# EAGLE schematic EEZ PSU consolidated r5B11 (EAGLE 6.1), part 1 of 2
Assembly variants: Farnell, TME

## Sheet 1 of 11: Power pre-regulator
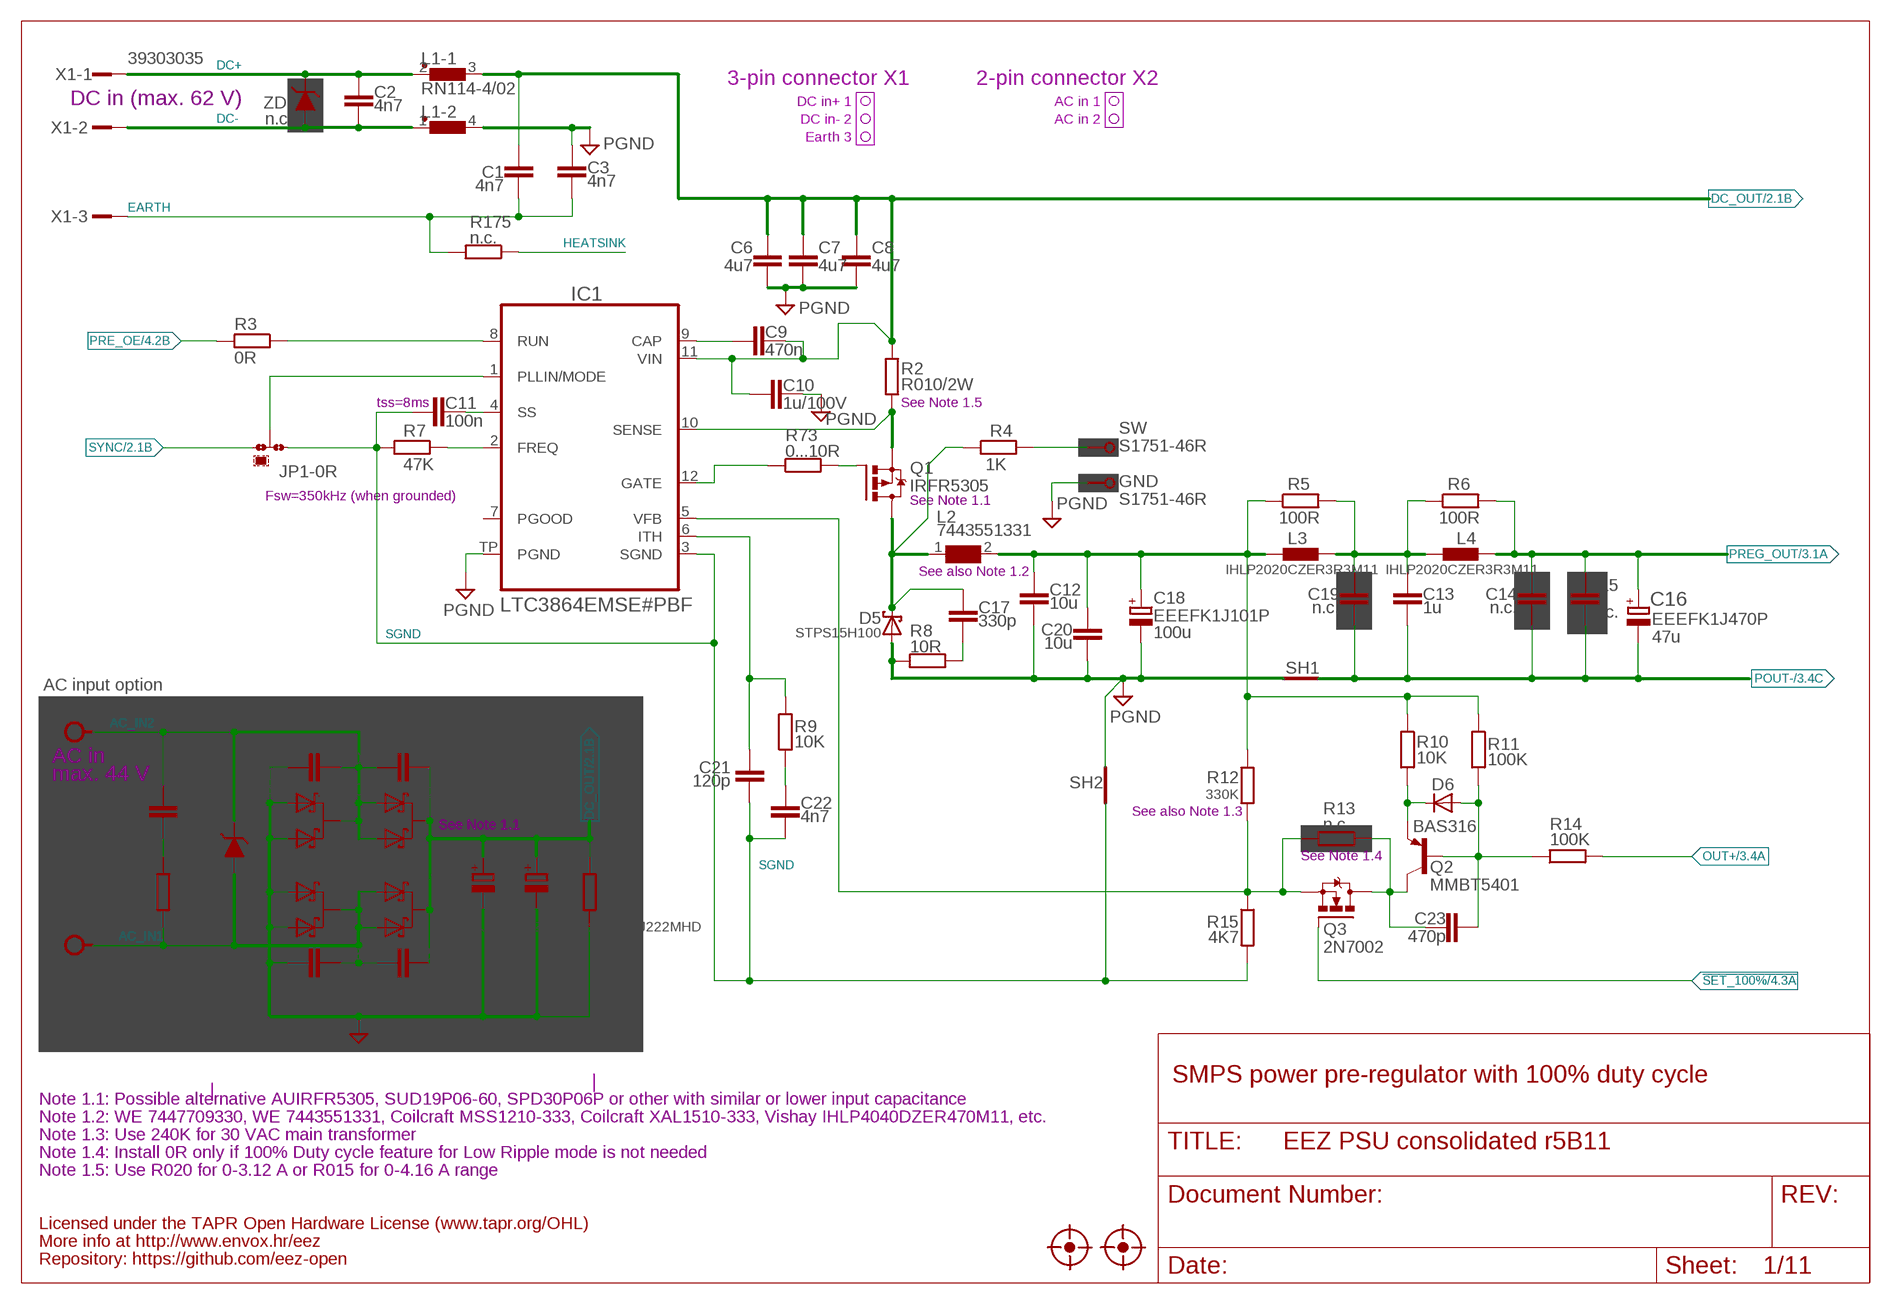
[diagram p0: schematic, sheet 1]

### Parts
C1  4n7  C-EUC1206  [C1206]
C2  4n7  C-EUC1206  [C1206]
C3  4n7  C-EUC1206  [C1206]
C4  2m2  ECAP7.5G_18MM  [ECAP7.5/18]
C5  2m2  ECAP7.5G_18MM  [ECAP7.5/18]
C6  4u7  C-EUC1210  [C1210]
C7  4u7  C-EUC1210  [C1210]
C8  4u7  C-EUC1210  [C1210]
C9  470n  C-EUC0805  [C0805]
C10  1u/100V  C-EUC1206  [C1206]
C11  100n  C-EUC0603  [C0603]
C12  10u  C-EUC1210  [C1210]
C13  1u  C-EUC0805  [C0805]
C14  n.c.  C-EUC0805  [C0805]
C15  n.c.  C-EUC0805  [C0805]
C16  EEEFK1J470P  EEE-FK1J470P-CASE-F  [CAPAE830X1050N]
C17  330p  C-EUC0805  [C0805]
C18  EEEFK1J101P  ECAPF  [PANASONIC_F]
C19  n.c.  C-EUC0805  [C0805]
C20  10u  C-EUC1210  [C1210]
C21  120p  C-EUC0805  [C0805]
C22  4n7  C-EUC0805  [C0805]
C23  470p  C-EUC0805  [C0805]
C158  n.c  C-EUC1206  [C1206]
C200  1n  C-EUC1206  [C1206]
C201  1n  C-EUC1206  [C1206]
C202  1n  C-EUC1206  [C1206]
C203  1n  C-EUC1206  [C1206]
D1  STPS15H100  VS-6CWQ06FNPBF  [TO252@1]
D2  STPS15H100  VS-6CWQ06FNPBF  [TO252@1]
D3  STPS15H100  VS-6CWQ06FNPBF  [TO252@1]
D4  STPS15H100  VS-6CWQ06FNPBF  [TO252@1]
D5  STPS15H100  SCHOTTKYTO252  [TO252]
D6  BAS316  DIODE-SOD323-W  [SOD323-W]
FM1  FIDUCIAL_2  [FIDUCIAL_DUAL]
FM2  FIDUCIAL_2  [FIDUCIAL_DUAL]
GND  S1751-46R  PCB_TEST_TABSMD  [S1751-46R]
IC1  LTC3864EMSE#PBF  LTC3864  [LTC_05-08-1666]
JP1  0R-JUMPA  [A0R-JMP]
L1  RN114-4/02  RN114  [RN114]
L2  7443551331  WE-HCI-7443551331_1350/1365  [WE-HCI_1350/1365]
L3  IHLP2020CZER3R3M11  IHLP-2020BZ-11  [IHLP-2020BZ-11]
L4  IHLP2020CZER3R3M11  IHLP-2020BZ-11  [IHLP-2020BZ-11]
Q1  IRFR5305  P-MOSFETDPAK  [TO229P990X239-3N]
Q2  MMBT5401  BC857B-PNP-SOT23-BEC  [SOT23-BEC]
Q3  2N7002  [SOT103P240X110-3N]
R1  12K  R-EU_R1206  [R1206]
R2  R010/2W  R-EU_R2512  [R2512]
R3  0R  R-EU_R0805  [R0805]
R4  1K  R-EU_R0805  [R0805]
R5  100R  R-EU_R0805  [R0805]
R6  100R  R-EU_R0805  [R0805]
R7  47K  R-EU_R0805  [R0805]
R8  10R  R-EU_R1206  [R1206]
R9  10K  R-EU_R0805  [R0805]
R10  10K  R-EU_R0805  [R0805]
R11  100K  R-EU_R0805  [R0805]
R12  330K  R-EU_R0805  [R0805]
R13  n.c.  R-EU_R0805  [R0805]
R14  100K  R-EU_R0805  [R0805]
R15  4K7  R-EU_R0805  [R0805]
R63  n.c.  R-EU_R1206  [R1206]
R73  0...10R  R-EU_R1206  [R1206]
R175  n.c.  R-EU_R0805  [R0805]
SH1  Pgnd to Pout- short  SHORTNOHOLE  [SHORT_NOHOLE]
SH2  Sgnd to Pgnd short  SHORTNOHOLE  [SHORT_NOHOLE]
SW  S1751-46R  PCB_TEST_TABSMD  [S1751-46R]
X1  39303035  MINIFIT-3PIN  [MINIFIT_6659-3]
X2  282836-2  TBLOCK5.0_2A  [TBLOCK5.0_2]
ZD1  n.c.  P6SMB68A  [DO214AA]
ZD2  n.c.  P6SMB68A  [DO214AA]

### Nets
!SET_100%: Q3.1(G) ; also sheet 4
AC_IN1: C202.1 C203.2 D3.3(C) D4.1(A1) D4.2(A2) R63.2 X2.1 ZD2.A
AC_IN2: C158.1 C200.1 C201.2 D1.3(C) D2.1(A1) D2.2(A2) X2.2 ZD2.C
DC+: C2.2 L1.2 X1.1 ZD1.C
DC-: C2.1 L1.1 X1.2 ZD1.A
DC_OUT: C1.2 C4.+ C5.+ C6.1 C7.1 C8.1 C9.2 C10.1 C201.1 C203.1 D2.3(C) D4.3(C) IC1.11(VIN) L1.3 R1.1 R2.1 ; also sheet 2,3
EARTH: C1.1 C3.2 R175.2 X1.3 ; also sheet 8,10
FB: IC1.5(VFB) Q3.2(S) R12.2 R13.2 R15.1
GND [gnd]: C3.1 C4.- C5.- C6.2 C7.2 C8.2 C10.2 C12.2 C18.2(-) C20.2 C200.2 C202.2 D1.1(A1) D1.2(A2) D3.1(A1) D3.2(A2) D5.1(A) D5.2(A) GND.P$1 IC1.TP(PGND) L1.4 R1.2 R8.1 SH1.P$2(GND_B) SH2.P$2(GND_B) ; supply symbol labelled PGND ; also sheet 2,3,4,5,6,7,8,9,10,11
HEATSINK: R175.1
L_OUT: C12.1 C18.1(+) C20.1 L2.2 L3.1 R5.1 R10.1 R11.1 R12.1
MODE: IC1.1(PLLIN/MODE) JP1.2
N$7: R4.2 SW.P$1
N$8: C158.2 R63.1
N$15: Q1.1(G) R73.2
N$19: D6.C Q2.E R10.2
N$20: C21.1 IC1.6(ITH) R9.2
N$21: C22.1 R9.1
N$23: C9.1 IC1.9(CAP)
N$30: IC1.12(GATE) R73.1
N$31: IC1.2(FREQ) R7.1
N$33: C11.2 IC1.4(SS)
N$34: C23.1 Q2.C Q3.3(D) R13.1
N$35: C13.1 C19.2 L3.2 L4.1 R5.2 R6.1
N$36: IC1.8(RUN) R3.1
N$38: C17.2 R8.2
N$79: C23.2 D6.A Q2.B R11.2 R14.1
OUT+: R14.2 ; also sheet 3,5
POUT-: C13.2 C14.2 C15.2 C16.2 C19.1 SH1.P$1(GND_A) ; also sheet 3
PRE_OE: R3.2 ; also sheet 4
PREG_OUT: C14.1 C15.1 C16.1 L4.2 R6.2 ; also sheet 3
SENSE: IC1.10(SENSE) Q1.3(S) R2.2
SGND: C11.1 C21.2 C22.2 IC1.3(SGND) JP1.1 R7.2 R15.2 SH2.P$1(GND_A)
SW: C17.1 D5.3(C) L2.1 Q1.2(D) R4.1
SYNC: JP1.3 ; also sheet 2
Unconnected: IC1.7(PGOOD)

### Notes on the sheet
- 3-pin connector X1 | 2-pin connector X2
- DC in+ 1 | AC in 1
- DC in (max. 62 V)
- DC in- 2 | AC in 2
- Earth 3
- tss=8ms | See Note 1.5
- Fsw=350kHz (when grounded)
- See Note 1.1
- See also Note 1.2
- 100u | 47u
- AC input option
- AC in
- max. 44 V
- See also Note 1.3
- See Note 1.1
- See Note 1.4
- 2 x UVZ1H222MHD or UVR1J222MHD
- SMPS power pre-regulator with 100% duty cycle
- Note 1.1: Possible alternative AUIRFR5305, SUD19P06-60, SPD30P06P or other with similar or lower input capacitance
- Note 1.2: WE 7447709330, WE 7443551331, Coilcraft MSS1210-333, Coilcraft XAL1510-333, Vishay IHLP4040DZER470M11, etc.
- Note 1.3: Use 240K for 30 VAC main transformer
- Note 1.4: Install 0R only if 100% Duty cycle feature for Low Ripple mode is not needed
- Note 1.5: Use R020 for 0-3.12 A or R015 for 0-4.16 A range
- Licensed under the TAPR Open Hardware License (www.tapr.org/OHL)
- More info at http://www.envox.hr/eez
- Repository: https://github.com/eez-open

## Sheet 2 of 11: Bias power
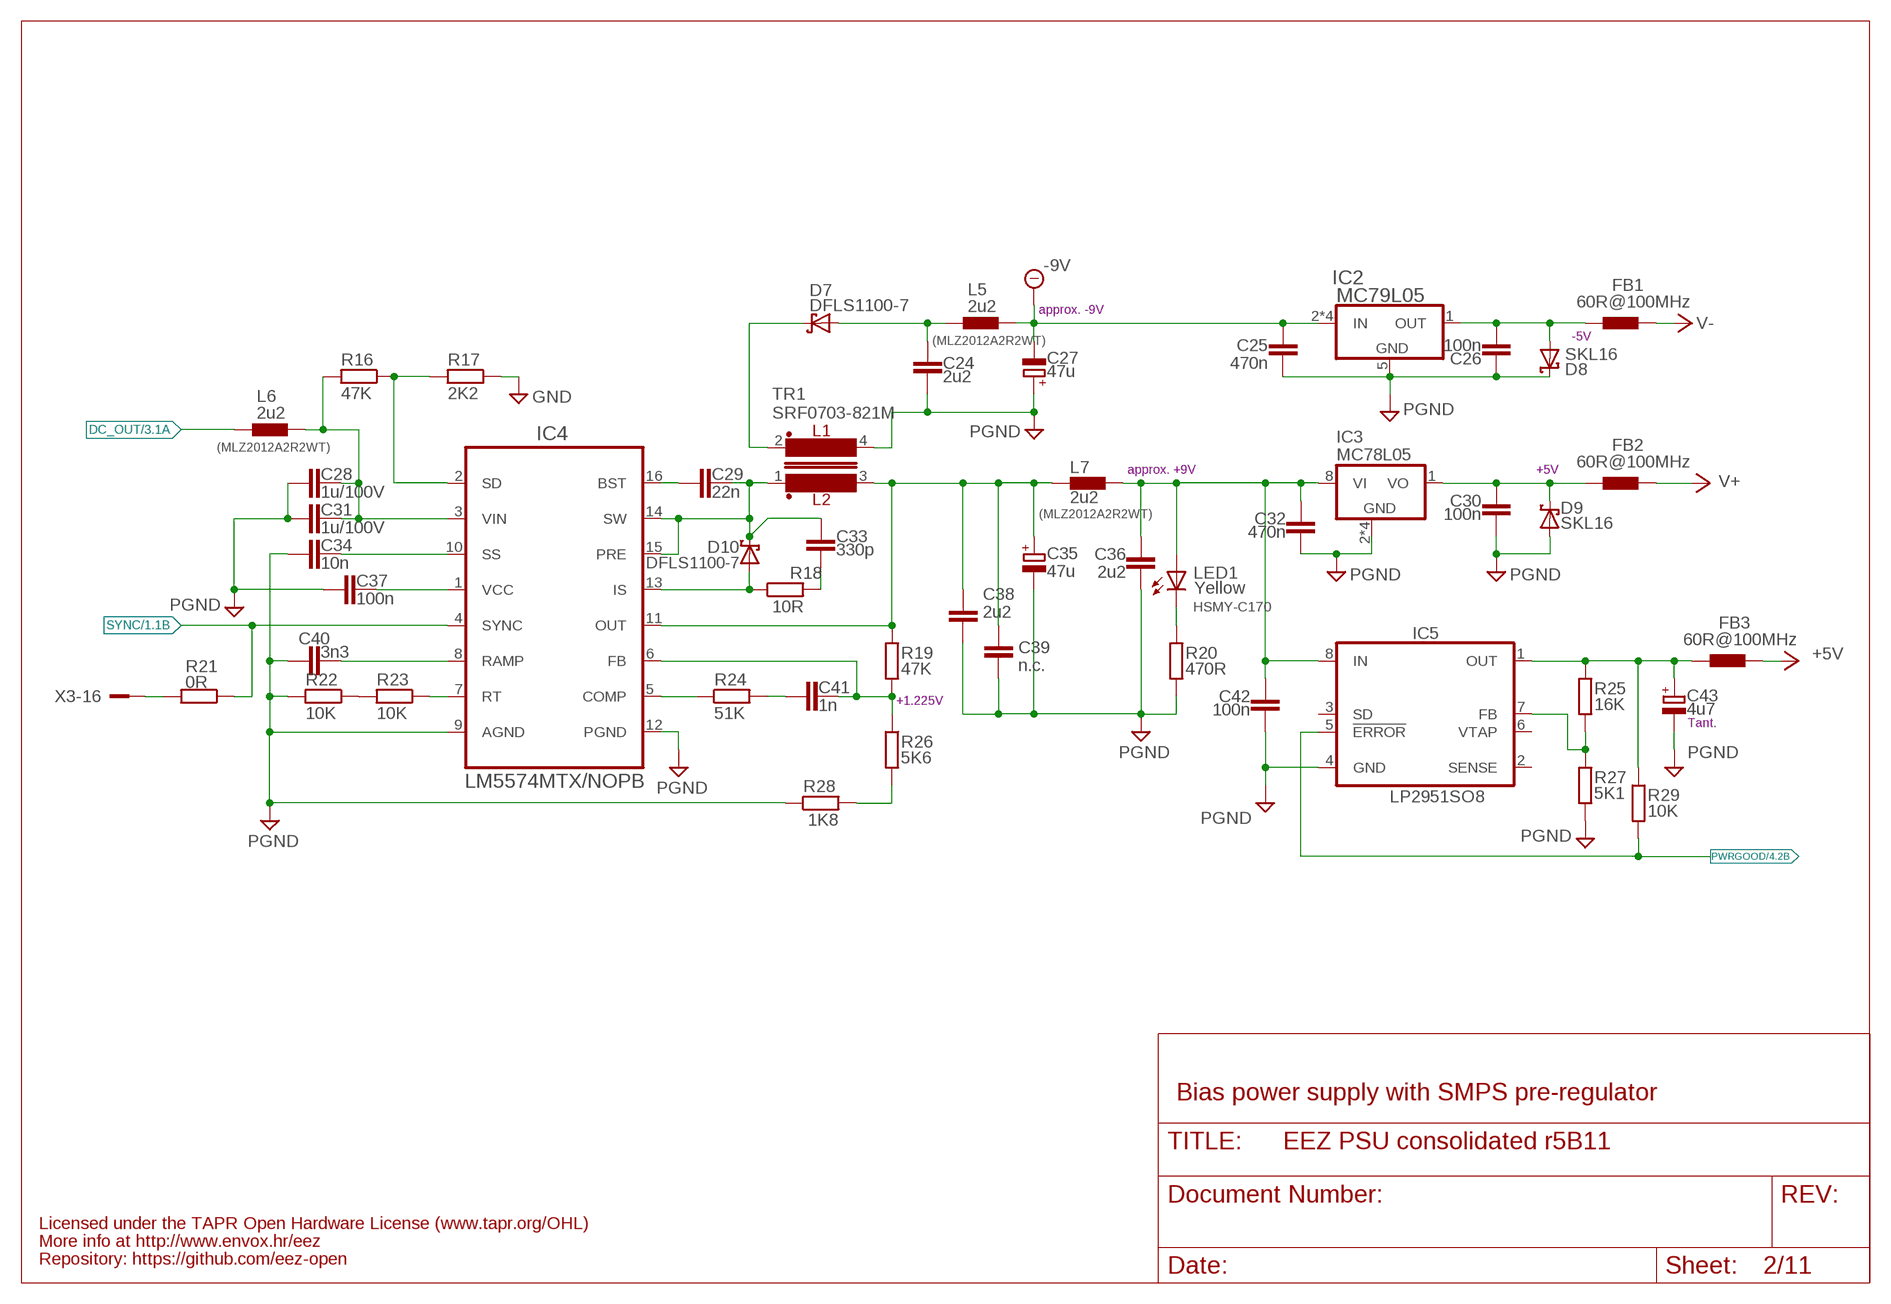
[diagram p1: schematic, sheet 2]

### Parts
C24  2u2  C-EUC0805  [C0805]
C25  470n  C-EUC0805  [C0805]
C26  100n  C-EUC0603  [C0603]
C27  47u  ECAPPANASONIC_H  [CAPAE660X610N]
C28  1u/100V  C-EUC1206  [C1206]
C29  22n  C-EUC0805  [C0805]
C30  100n  C-EUC0603  [C0603]
C31  1u/100V  C-EUC1206  [C1206]
C32  470n  C-EUC0805  [C0805]
C33  330p  C-EUC0805  [C0805]
C34  10n  C-EUC0805  [C0805]
C35  47u  ECAPPANASONIC_H  [CAPAE660X610N]
C36  2u2  C-EUC0805  [C0805]  (variant Farnell: 2320829)  (variant TME: CL21B225KAFNNNG )
C37  100n  C-EUC0603  [C0603]
C38  2u2  C-EUC0805  [C0805]  (variant Farnell: 2320829)  (variant TME: CL21B225KAFNNNG )
C39  n.c.  C-EUC0805  [C0805]  (variant Farnell: 2320829)  (variant TME: CL21B225KAFNNNG )
C40  3n3  C-EUC0805  [C0805]
C41  1n  C-EUC0805  [C0805]
C42  100n  C-EUC0603  [C0603]
C43  4u7  ECAP1206  [EC1206]
D7  DFLS1100-7  SCHOTTKYSOD123  [SOD123]
D8  SKL16  SCHOTTKYSOD123  [SOD123]
D9  SKL16  SCHOTTKYSOD123  [SOD123]
D10  DFLS1100-7  SCHOTTKYSOD123  [SOD123]
FB1  60R@100MHz  FERRITE_BEAD0603  [BEAD0603]
FB2  60R@100MHz  FERRITE_BEAD0603  [BEAD0603]
FB3  60R@100MHz  FERRITE_BEAD0603  [BEAD0603]
IC2  MC79L05  MC79LXXSOIC  [SOIC127P600X173-8N]
IC3  MC78L05  MC78LXXSOIC8  [SOIC127P600X173-8N]
IC4  LM5574MTX/NOPB  LM5574  [SOP65P640X110-16N]
IC5  LP2951SO8  [SOIC127P600X175-8N]
L5  2u2  L-EU0805  [0805]
L6  2u2  L-EU0805  [0805]
L7  2u2  L-EU0805  [0805]
LED1  HSMY-C170  LED0805  [LED_0805]
R16  47K  R-EU_R0805  [R0805]
R17  2K2  R-EU_R0805  [R0805]
R18  10R  R-EU_R1206  [R1206]
R19  47K  R-EU_R0805  [R0805]
R20  470R  R-EU_R0805  [R0805]
R21  0R  R-EU_R0805  [R0805]
R22  10K  R-EU_R0805  [R0805]
R23  10K  R-EU_R0805  [R0805]
R24  51K  R-EU_R0805  [R0805]
R25  16K  R-EU_R0805  [R0805]
R26  5K6  R-EU_R0805  [R0805]
R27  5K1  R-EU_R0805  [R0805]
R28  1K8  R-EU_R0805  [R0805]
R29  10K  R-EU_R0805  [R0805]
TR1  SRF0703-821M  BOURNS_SRF0703INV  [SRF0703]
X3  SSW-113-02-T-D-RA  [SSW-113-02-T-D-RA]

### Nets
+5V: FB3.P$2 ; also sheet 3,4,5,6,7,8,9,10,11
+VNR: C32.1 C36.1 C42.1 IC3.8(VI) IC5.8(IN) L7.2 LED1.A
-9V: C25.2 C27.2(-) IC2.2(IN) IC2.3(IN) IC2.6(IN) IC2.7(IN) L5.2 ; also sheet 3
DC_OUT: L6.1 ; also sheet 1,3
DC_PREG1: C28.1 C31.1 IC4.3(VIN) L6.2 R16.2
GND [gnd]: C24.2 C25.1 C26.1 C27.1(+) C28.2 C30.2 C31.2 C32.2 C34.2 C35.2(-) C36.2 C37.1 C38.2 C39.2 C40.1 C42.2 C43.- D8.C D9.A IC2.5(GND) IC3.2(GND) IC3.3(GND) IC3.6(GND) IC3.7(GND) IC4.9(AGND) IC4.12(PGND) IC5.4(GND) R17.1 R20.2 R22.2 R27.2 R28.1 TR1.4 ; supply symbol labelled PGND ; also sheet 1,3,4,5,6,7,8,9,10,11
IS: D10.A IC4.13(IS) R18.1
N$4: C26.2 D8.A FB1.P$1 IC2.1(OUT)
N$5: C30.1 D9.C FB2.P$1 IC3.1(VO)
N$6: C43.+ FB3.P$1 IC5.1(OUT) R25.1 R29.1
N$24: R21.2 X3.16
N$43: LED1.C R20.1
N$46: C33.2 R18.2
N$64: IC5.7(FB) R25.2 R27.1
N$77: C41.2 R24.2
N$78 [gnd]: R26.2 R28.2
N$80: R22.1 R23.2
N$128: C41.1 IC4.6(FB) R19.2 R26.1
N$131: C29.2 IC4.16(BST)
N$135: IC4.5(COMP) R24.1
N$165: IC4.7(RT) R23.1
N$166: C37.2 IC4.1(VCC)
N$167: C40.2 IC4.8(RAMP)
N$168: C34.1 IC4.10(SS)
N$179: C24.1 D7.A L5.1
N$180: IC4.2(SD) R16.1 R17.2
PWRGOOD: IC5.5(!ERROR) R29.2 ; also sheet 4
SW1: C29.1 C33.1 D10.C IC4.14(SW) IC4.15(PRE) TR1.1
SYNC: IC4.4(SYNC) R21.1 ; also sheet 1
V+: FB2.P$2 ; also sheet 3,4,5
V-: FB1.P$2 ; also sheet 3,4,5
VOUT+: C35.1(+) C38.1 C39.1 IC4.11(OUT) L7.1 R19.1 TR1.3
VOUT-: D7.C TR1.2
Unconnected: IC5.2(SENSE) IC5.3(SD) IC5.6(VTAP)

### Notes on the sheet
- approx. -9V
- -5V
- (MLZ2012A2R2WT)
- (MLZ2012A2R2WT)
- approx. +9V | +5V
- (MLZ2012A2R2WT)
- Yellow
- +1.225V
- Tant.
- Bias power supply with SMPS pre-regulator
- Licensed under the TAPR Open Hardware License (www.tapr.org/OHL)
- More info at http://www.envox.hr/eez
- Repository: https://github.com/eez-open

## Sheet 3 of 11: Post-regulator
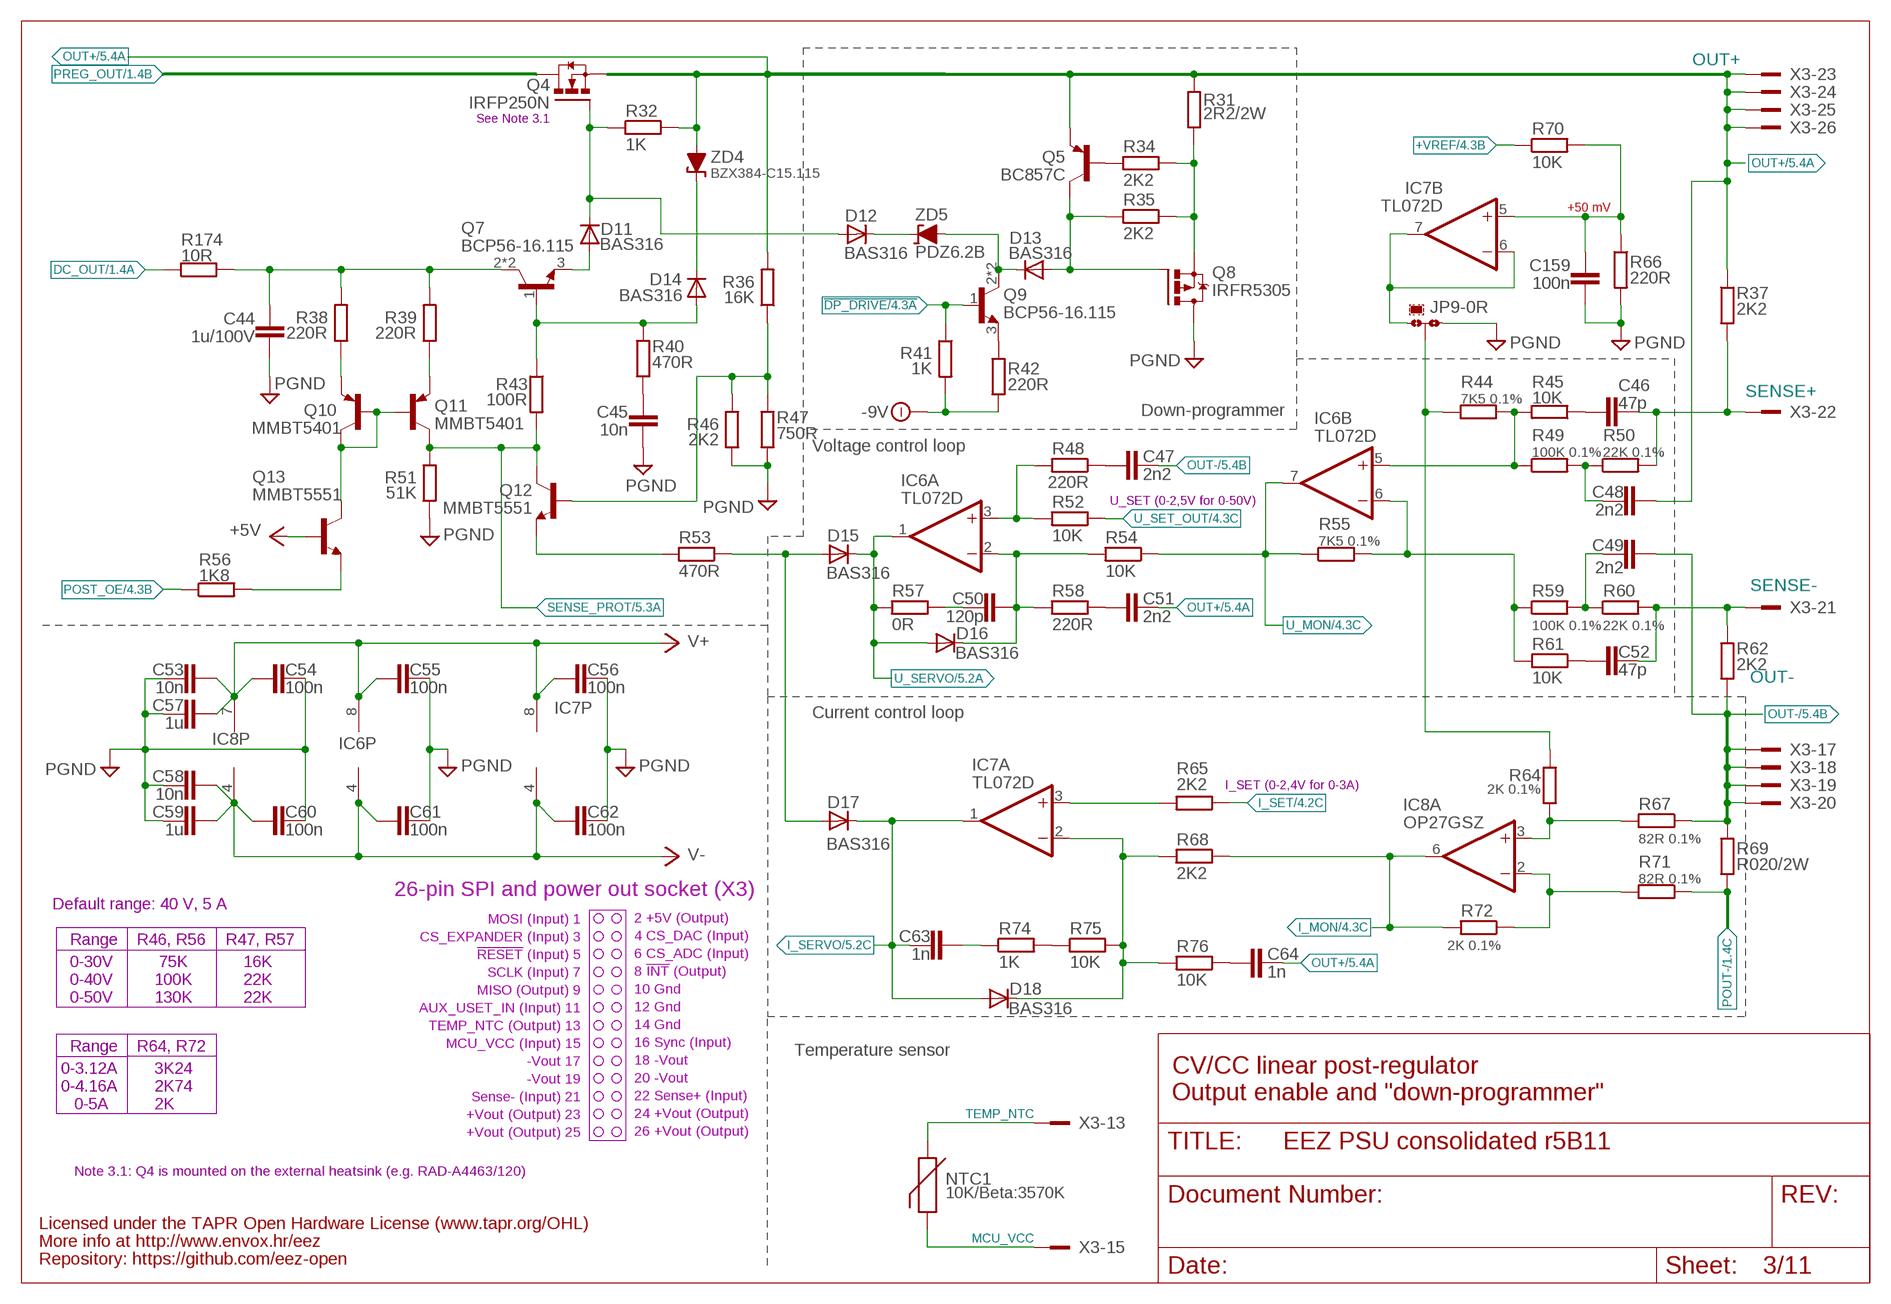
[diagram p2: schematic, sheet 3]

### Parts
C44  1u/100V  C-EUC1206  [C1206]
C45  10n  C-EUC0805  [C0805]
C46  47p  C-EUC0805  [C0805]
C47  2n2  C-EUC0805  [C0805]
C48  2n2  C-EUC0805  [C0805]
C49  2n2  C-EUC0805  [C0805]
C50  120p  C-EUC0805  [C0805]
C51  2n2  C-EUC0805  [C0805]
C52  47p  C-EUC0805  [C0805]
C53  10n  C-EUC0805  [C0805]
C54  100n  C-EUC0603  [C0603]
C55  100n  C-EUC0603  [C0603]
C56  100n  C-EUC0603  [C0603]
C57  1u  C-EUC0805  [C0805]
C58  10n  C-EUC0805  [C0805]
C59  1u  C-EUC0805  [C0805]
C60  100n  C-EUC0603  [C0603]
C61  100n  C-EUC0603  [C0603]
C62  100n  C-EUC0603  [C0603]
C63  1n  C-EUC0805  [C0805]
C64  1n  C-EUC0805  [C0805]
C159  100n  C-EUC0603  [C0603]
D11  BAS316  DIODE-SOD323-W  [SOD323-W]
D12  BAS316  DIODE-SOD323-W  [SOD323-W]
D13  BAS316  DIODE-SOD323-W  [SOD323-W]
D14  BAS316  DIODE-SOD323-W  [SOD323-W]
D15  BAS316  DIODE-SOD323-W  [SOD323-W]
D16  BAS316  DIODE-SOD323-W  [SOD323-W]
D17  BAS316  DIODE-SOD323-W  [SOD323-W]
D18  BAS316  DIODE-SOD323-W  [SOD323-W]
IC6  TL072D  TL072SOIC8  [SOIC127P600X173-8N]
IC7  TL072D  TL072SOIC8  [SOIC127P600X173-8N]
IC8  OP27GSZ  OP27GSZSO8  [SOIC127P600X173-8N]
JP9  0R-JUMPA  [A0R-JMP]
NTC1  10K/Beta:3570K  NTC0805  [R_0204/5+0805]
Q4  IRFP250N  IRFP240BOTTOM  [TO247BH-CLR]
Q5  BC857C  BC857C-PNP-SOT23-BEC  [SOT23-BEC]
Q7  BCP56-16.115  BCP56  [SOT230P700X180-4N]
Q8  IRFR5305  P-MOSFETDPAK  [TO229P990X239-3N]
Q9  BCP56-16.115  BCP56  [SOT230P700X180-4N]
Q10  MMBT5401  BC857B-PNP-SOT23-BEC  [SOT23-BEC]
Q11  MMBT5401  BC857B-PNP-SOT23-BEC  [SOT23-BEC]
Q12  MMBT5551  MMBT5551LT1-NPN-SOT23-BEC  [SOT23-BEC]
Q13  MMBT5551  MMBT5551LT1-NPN-SOT23-BEC  [SOT23-BEC]
R31  2R2/2W  R-EU_R2512  [R2512]
R32  1K  R-EU_R0805  [R0805]
R34  2K2  R-EU_R0805  [R0805]
R35  2K2  R-EU_R0805  [R0805]
R36  16K  R-EU_R0805  [R0805]
R37  2K2  R-EU_R0805  [R0805]
R38  220R  R-EU_R0805  [R0805]
R39  220R  R-EU_R0805  [R0805]
R40  470R  R-EU_R0805  [R0805]
R41  1K  R-EU_R0805  [R0805]
R42  220R  R-EU_R0805  [R0805]
R43  100R  R-EU_R0805  [R0805]
R44  7K5 0.1%  R-EU_R0805  [R0805]
R45  10K  R-EU_R0805  [R0805]
R46  2K2  R-EU_R0805  [R0805]
R47  750R  R-EU_R0805  [R0805]
R48  220R  R-EU_R0805  [R0805]
R49  100K 0.1%  R-EU_R0805  [R0805]
R50  22K 0.1%  R-EU_R0805  [R0805]
R51  51K  R-EU_R0805  [R0805]
R52  10K  R-EU_R0805  [R0805]
R53  470R  R-EU_R0805  [R0805]
R54  10K  R-EU_R0805  [R0805]
R55  7K5 0.1%  R-EU_R0805  [R0805]
R56  1K8  R-EU_R0805  [R0805]
R57  0R  R-EU_R0805  [R0805]
R58  220R  R-EU_R0805  [R0805]
R59  100K 0.1%  R-EU_R0805  [R0805]
R60  22K 0.1%  R-EU_R0805  [R0805]
R61  10K  R-EU_R0805  [R0805]
R62  2K2  R-EU_R0805  [R0805]
R64  2K 0.1%  R-EU_R0805  [R0805]
R65  2K2  R-EU_R0805  [R0805]
R66  220R  R-EU_R0805  [R0805]
R67  82R 0.1%  R-EU_R0805  [R0805]
R68  2K2  R-EU_R0805  [R0805]
R69  R020/2W  R-EU_R2512  [R2512]
R70  10K  R-EU_R0805  [R0805]
R71  82R 0.1%  R-EU_R0805  [R0805]
R72  2K 0.1%  R-EU_R0805  [R0805]
R74  1K  R-EU_R0805  [R0805]
R75  10K  R-EU_R0805  [R0805]
R76  10K  R-EU_R0805  [R0805]
R174  10R  R-EU_R1206  [R1206]
ZD4  BZX384-C15.115  ZENER-DIODESOD323  [SOD323-W]
ZD5  PDZ6.2B  ZENER-DIODESOD323  [SOD323-W]

### Nets
!DP_DRIVE: Q9.1(B) R41.1 ; also sheet 4
+5V: Q13.B ; also sheet 2,4,5,6,7,8,9,10,11
+VREF: R70.1 ; also sheet 4
-9V: R41.2 R42.2 ; also sheet 2
DC_BIAS: C44.1 Q7.2(C) Q7.4(C) R38.2 R39.2 R174.2
DC_OUT: R174.1 ; also sheet 1,2
GCOM [gnd]: JP9.2 R44.1 R64.1
GND [gnd]: C44.2 C45.2 C53.1 C54.2 C55.1 C56.1 C57.1 C58.1 C59.1 C60.2 C61.1 C62.1 C159.2 JP9.3 Q8.2(D) R46.1 R47.1 R51.1 R66.2 ; supply symbol labelled PGND ; also sheet 1,2,4,5,6,7,8,9,10,11
I_MON: IC8.6(A:OUT) R68.1 R72.2 ; also sheet 4
I_SERVO: C63.2 D17.C D18.A IC7.1(A:OUT) ; also sheet 5
I_SET: R65.1 ; also sheet 4
ISENSE+: IC8.3(A:+IN) R64.2 R67.2
ISENSE-: IC8.2(A:-IN) R71.2 R72.1
MCU_VCC: NTC1.2 NTC1.2.1 X3.15
N$1: Q9.3(E) R42.1
N$2: Q5.B R34.2
N$3: C46.2 R45.1
N$10: C52.2 R61.1
N$13: C159.1 IC7.5(B:+IN) R66.1 R70.2
N$16: IC7.6(B:-IN) IC7.7(B:OUT) JP9.1
N$17: C49.1 R59.2 R60.1
N$18: C50.2 R57.1
N$22: C64.2 R76.1
N$26: C47.2 R48.1
N$27: C51.2 R58.1
N$29: IC6.3(A:+IN) R48.2 R52.2
N$32: C50.1 D16.C IC6.2(A:-IN) R54.2 R58.2
N$37: D18.C IC7.2(A:-IN) R68.2 R75.2 R76.2
N$44: Q12.B R36.1 R46.2 R47.2
N$50: IC7.3(A:+IN) R65.2
N$54: D15.A D17.A R53.1
N$56: D11.C D12.A Q4.G R32.1
N$62: D11.A Q7.3(E)
N$65: D14.A Q7.1(B) R40.2 R43.1
N$67: C45.1 R40.1
N$117: C48.1 R49.2 R50.1
N$129: D14.C ZD4.C
N$143: D12.C ZD5.C
N$145: Q12.E R53.2
N$146: Q8.3(S) R31.1 R34.1 R35.1
N$147: D13.A Q5.C Q8.1(G) R35.2
N$150: IC6.5(B:+IN) R44.2 R45.2 R49.1
N$158: IC6.6(B:-IN) R55.2 R59.1 R61.2
N$160: R74.2 R75.1
N$162: C63.1 R74.1
N$183: Q11.E R39.1
N$184: Q10.E R38.1
N$186: Q13.E R56.2
OUT+: C48.2 C51.1 C64.1 Q4.S Q5.E R31.2 R32.2 R36.2 R37.1 X3.23 X3.24 X3.25 X3.26 ZD4.A ; also sheet 1,5
OUT-: C47.1 C49.2 R62.2 R67.1 R69.1 X3.17 X3.18 X3.19 X3.20 ; also sheet 5
POST_OE: R56.1 ; also sheet 4
POUT-: R69.2 R71.1 ; also sheet 1
PREG_OUT: Q4.D ; also sheet 1
Q7C: Q10.B Q10.C Q11.B Q13.C
Q9C: D13.C Q9.2(C) Q9.4(C) ZD5.A
SENSE+: C46.1 R37.2 R50.2 X3.22 ; also sheet 5
SENSE-: C52.1 R60.2 R62.1 X3.21 ; also sheet 5
SENSE_PROT: Q11.C Q12.C R43.2 R51.2 ; also sheet 5
TEMP_NTC: NTC1.1 NTC1.1.1 X3.13
U_MON: IC6.7(B:OUT) R54.1 R55.1 ; also sheet 4
U_SERVO: D15.C D16.A IC6.1(A:OUT) R57.2 ; also sheet 5
U_SET_OUT: R52.1 ; also sheet 4
V+: C53.2 C54.1 C55.2 C56.2 C57.2 IC6.8(P:V+) IC7.8(P:V+) IC8.7(P:V+) ; also sheet 2,4,5
V-: C58.2 C59.2 C60.1 C61.2 C62.2 IC6.4(P:V-) IC7.4(P:V-) IC8.4(P:V-) ; also sheet 2,4,5

### Notes on the sheet
- See Note 3.1
- +50 mV
- Down-programmer
- Voltage control loop
- U_SET (0-2,5V for 0-50V)
- Current control loop
- I_SET (0-2,4V for 0-3A)
- 26-pin SPI and power out socket (X3)
- Default range: 40 V, 5 A
- MOSI (Input) 1
- 2 +5V (Output)
- CS_EXPANDER (Input) 3
- 4 CS_DAC (Input)
- Range | R46, R56 | R47, R57
- !RESET! (Input) 5
- 6 CS_ADC (Input)
- 0-30V | 75K | 16K | SCLK (Input) 7
- 8 !INT! (Output)
- 0-40V | 100K | 22K | MISO (Output) 9
- 10 Gnd
- 0-50V | 130K | 22K | AUX_USET_IN (Input) 11
- 12 Gnd
- TEMP_NTC (Output) 13
- 14 Gnd
- MCU_VCC (Input) 15
- 16 Sync (Input)
- Range | R64, R72
- -Vout 17 | Temperature sensor
- 18 -Vout
- 0-3.12A | 3K24 | -Vout 19 | CV/CC linear post-regulator
- 20 -Vout
- 0-4.16A | 2K74 | Sense- (Input) 21
- 22 Sense+ (Input) | Output enable and "down-programmer"
- 0-5A | 2K | +Vout (Output) 23
- 24 +Vout (Output)
- +Vout (Output) 25
- 26 +Vout (Output)
- Note 3.1: Q4 is mounted on the external heatsink (e.g. RAD-A4463/120)
- Licensed under the TAPR Open Hardware License (www.tapr.org/OHL)
- More info at http://www.envox.hr/eez
- Repository: https://github.com/eez-open

## Sheet 4 of 11: Digital control, voltage reference
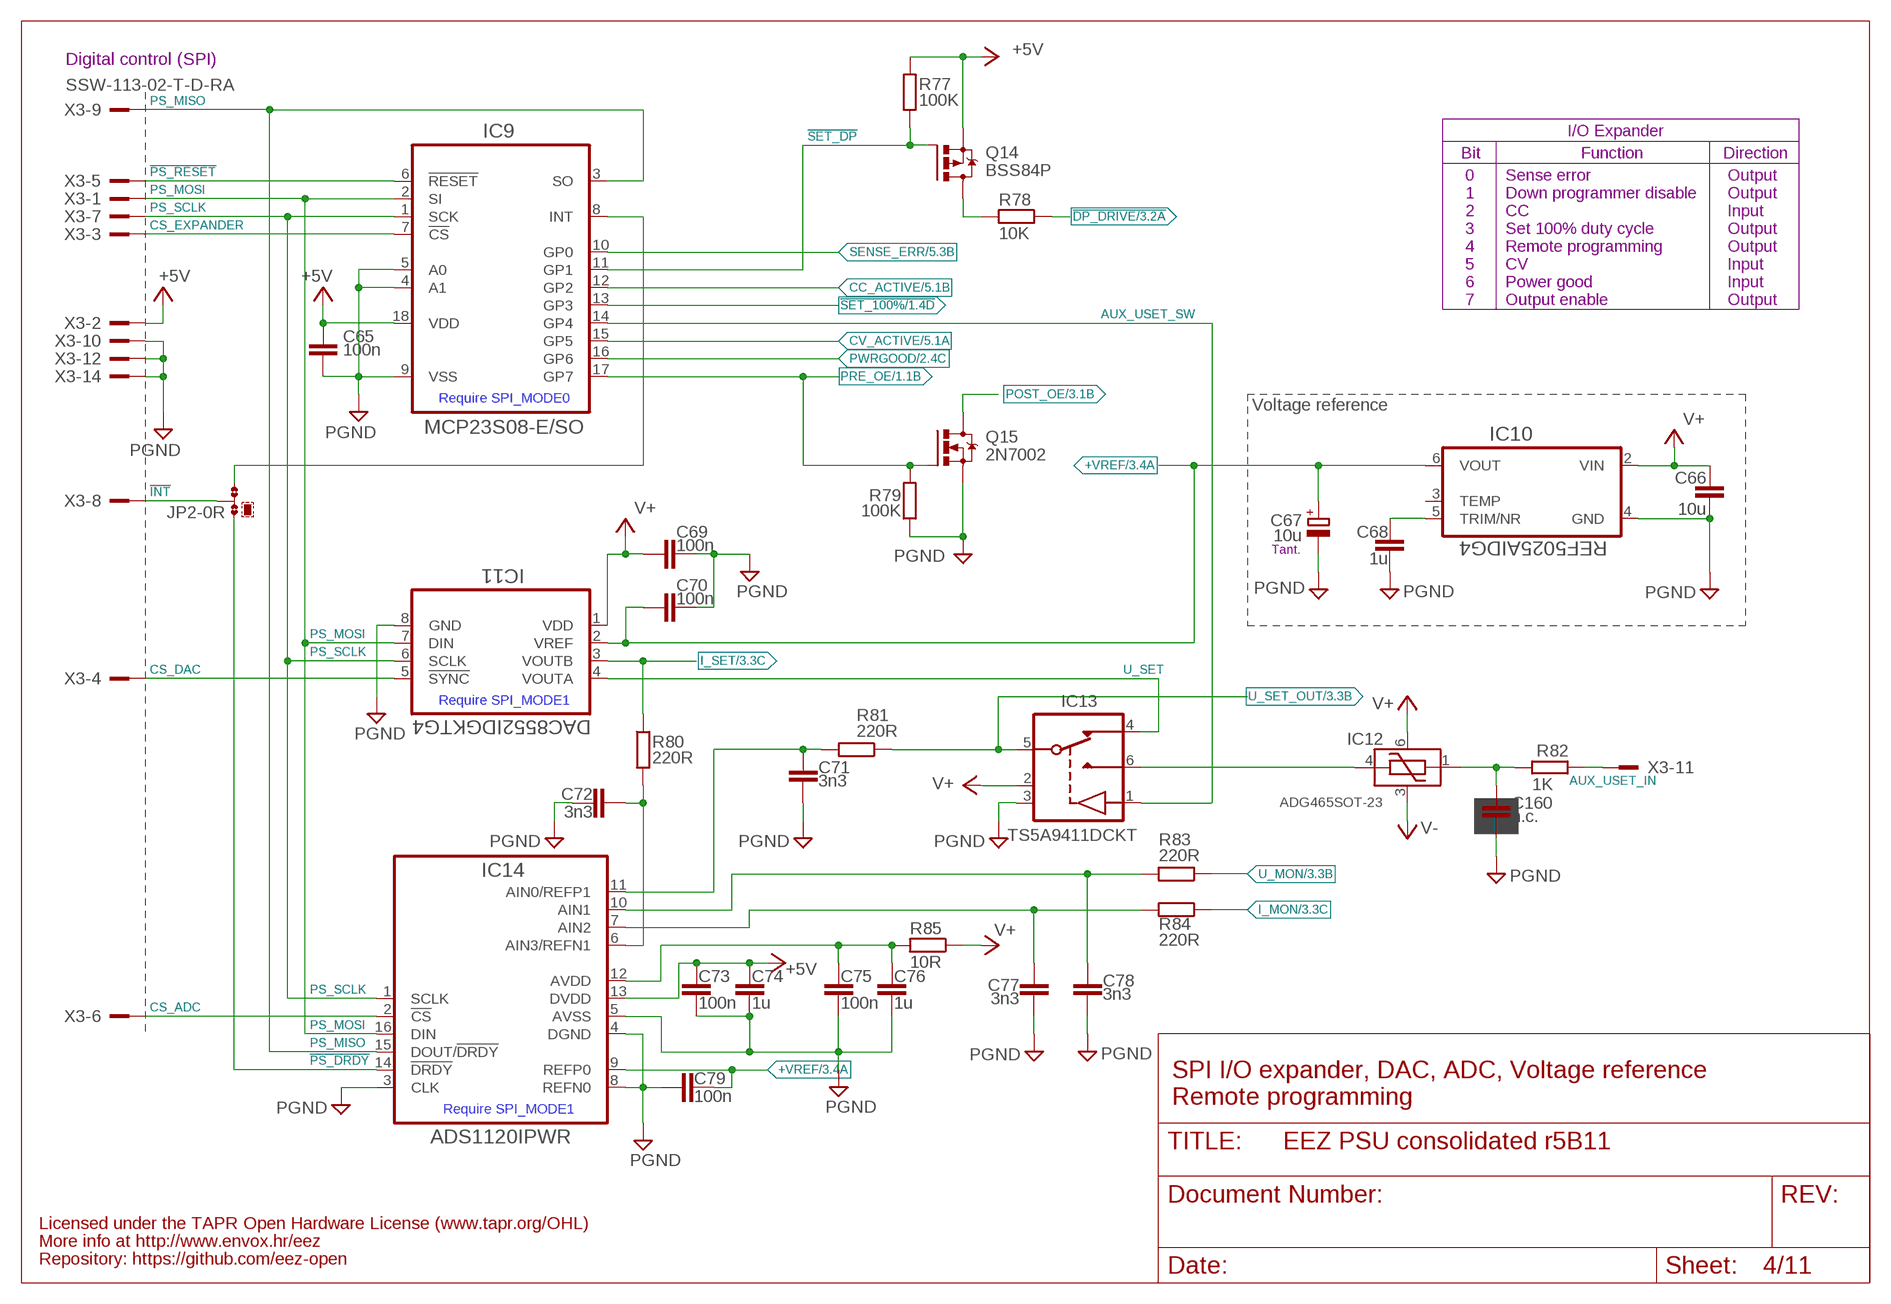
[diagram p3: schematic, sheet 4]

### Parts
C65  100n  C-EUC0603  [C0603]
C66  10u  C-EUC1210  [C1210]
C67  10u  ECAP1206  [EC1206]
C68  1u  C-EUC0805  [C0805]
C69  100n  C-EUC0603  [C0603]
C70  100n  C-EUC0603  [C0603]
C71  3n3  C-EUC0805  [C0805]
C72  3n3  C-EUC0805  [C0805]
C73  100n  C-EUC0603  [C0603]
C74  1u  C-EUC0805  [C0805]
C75  100n  C-EUC0603  [C0603]
C76  1u  C-EUC0805  [C0805]
C77  3n3  C-EUC0805  [C0805]
C78  3n3  C-EUC0805  [C0805]
C79  100n  C-EUC0603  [C0603]
C160  n.c.  C-EUC0805  [C0805]
IC9  MCP23S08-E/SO  MCP23S08  [SOIC127P1030X265-18N]
IC10  REF5025AIDG4  REF50XX  [SOIC127P600X175-8N]
IC11  DAC8552IDGKTG4  DAC8552_DGK_8M  [DGK8-M]
IC12  ADG465SOT-23  [SOT95P280X145-6N]
IC13  TS5A9411DCKT  [SOT65P210X110-6N]
IC14  ADS1120IPWR  ADS1120TSSOP-16  [PW(R-PDSO-G16)]
JP2  0R-JUMPA  [A0R-JMP]
Q14  BSS84P  IRLML2246TRPBF  [SOT95P237X112-3N]
Q15  2N7002  [SOT103P240X110-3N]
R77  100K  R-EU_R0805  [R0805]
R78  10K  R-EU_R0805  [R0805]
R79  100K  R-EU_R0805  [R0805]
R80  220R  R-EU_R0805  [R0805]
R81  220R  R-EU_R0805  [R0805]
R82  1K  R-EU_R0805  [R0805]
R83  220R  R-EU_R0805  [R0805]
R84  220R  R-EU_R0805  [R0805]
R85  10R  R-EU_R1206  [R1206]

### Nets
!DP_DRIVE: R78.1 ; also sheet 3
!INT: JP2.2 X3.8
!PS_DRDY: IC14.14(!DRDY) JP2.3
!PS_RESET: IC9.6(!RESET) X3.5
!SET_100%: IC9.13(GP3) ; also sheet 1
!SET_DP: IC9.11(GP1) Q14.1(G) R77.2
+5V: C65.1 C73.2 C74.2 IC9.18(VDD) IC14.13(DVDD) Q14.2(S) R77.1 X3.2 ; also sheet 2,3,5,6,7,8,9,10,11
+VREF: C67.+ C70.2 C79.2 IC10.6(VOUT) IC11.2(VREF) IC14.9(REFP0) ; also sheet 3
AUX_USET_IN: R82.2 X3.11
AUX_USET_SW: IC9.14(GP4) IC13.1(IN)
CC_ACTIVE: IC9.12(GP2) ; also sheet 5
CS_ADC: IC14.2(!CS) X3.6
CS_DAC: IC11.5(!SYNC) X3.4
CS_EXPANDER: IC9.7(!CS) X3.3
CV_ACTIVE: IC9.15(GP5) ; also sheet 5
DP_LED: Q14.3(D) R78.2
GND [gnd]: C65.2 C66.2 C67.- C68.2 C69.1 C70.1 C71.1 C72.2 C73.1 C74.1 C75.1 C76.1 C77.1 C78.1 C79.1 C160.1 IC9.4(A1) IC9.5(A0) IC9.9(VSS) IC10.4(GND) IC11.8(GND) IC13.3(GND) IC14.3(CLK) IC14.4(DGND) IC14.5(AVSS) IC14.8(REFN0) Q15.2(S) R79.1 X3.10 X3.12 X3.14 ; supply symbol labelled PGND ; also sheet 1,2,3,5,6,7,8,9,10,11
I_MON: R84.1 ; also sheet 3
I_SET: IC11.3(VOUTB) R80.1 ; also sheet 3
INT_EXP: IC9.8(INT) JP2.1
N$9: IC12.4(VS) IC13.6(S1)
N$11: C68.1 IC10.5(TRIM/NR)
N$12: C160.2 IC12.1(VD) R82.1
N$28: C78.2 IC14.10(AIN1) R83.2
N$41: C71.2 IC14.11(AIN0/REFP1) R81.2
N$42: C75.2 C76.2 IC14.12(AVDD) R85.2
N$51: C72.1 IC14.6(AIN3/REFN1) R80.2
N$55: C77.2 IC14.7(AIN2) R84.2
POST_OE: Q15.3(D) ; also sheet 3
PRE_OE: IC9.17(GP7) Q15.1(G) R79.2 ; also sheet 1
PS_MISO: IC9.3(SO) IC14.15(DOUT/!DRDY) X3.9
PS_MOSI: IC9.2(SI) IC11.7(DIN) IC14.16(DIN) X3.1
PS_SCLK: IC9.1(SCK) IC11.6(SCLK) IC14.1(SCLK) X3.7
PWRGOOD: IC9.16(GP6) ; also sheet 2
SENSE_ERR: IC9.10(GP0) ; also sheet 5
U_MON: R83.1 ; also sheet 3
U_SET: IC11.4(VOUTA) IC13.4(S2)
U_SET_OUT: IC13.5(D) R81.1 ; also sheet 3
V+: C66.1 C69.2 IC10.2(VIN) IC11.1(VDD) IC12.6(VDD) IC13.2(VDD) R85.1 ; also sheet 2,3,5
V-: IC12.3(VSS) ; also sheet 2,3,5
Unconnected: IC10.3(TEMP)

### Notes on the sheet
- Digital control (SPI)
- I/O Expander
- Bit | Function | Direction
- 0 | Sense error | Output
- 1 | Down programmer disable | Output
- 2 | CC | Input
- 3 | Set 100% duty cycle | Output
- 4 | Remote programming | Output
- 5 | CV | Input
- 6 | Power good | Input
- 7 | Output enable | Output
- Voltage reference
- Require SPI_MODE0
- Tant.
- Require SPI_MODE1
- SPI I/O expander, DAC, ADC, Voltage reference
- Remote programming
- Require SPI_MODE1
- Licensed under the TAPR Open Hardware License (www.tapr.org/OHL)
- More info at http://www.envox.hr/eez
- Repository: https://github.com/eez-open

## Sheet 5 of 11: CC/CV, Remote sense protection
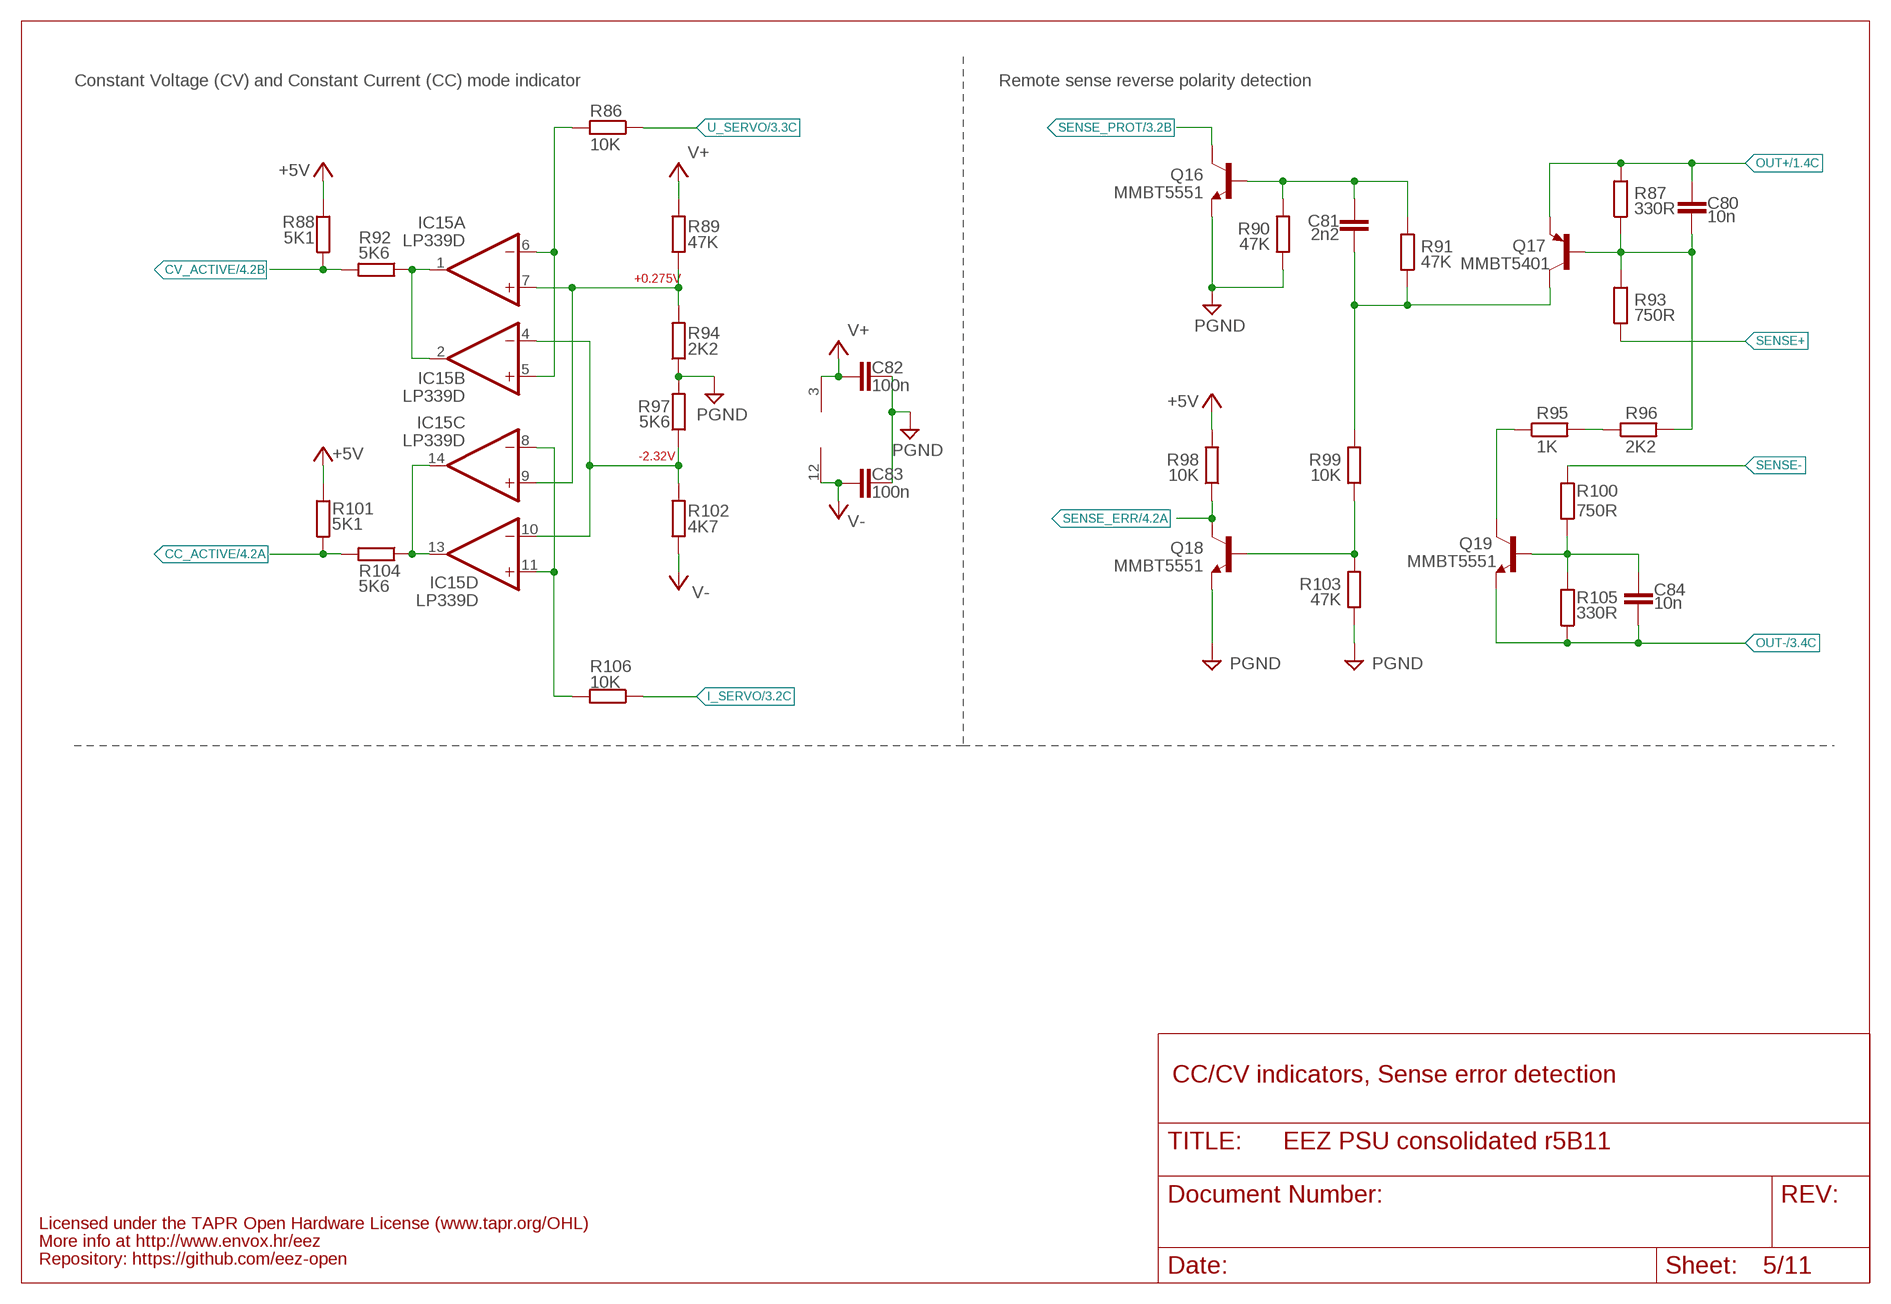
[diagram p4: schematic, sheet 5]

### Parts
C80  10n  C-EUC0805  [C0805]
C81  2n2  C-EUC0805  [C0805]
C82  100n  C-EUC0603  [C0603]
C83  100n  C-EUC0603  [C0603]
C84  10n  C-EUC0805  [C0805]
IC15  LP339D  LM339SO14  [SOIC127P600X175-14N]
Q16  MMBT5551  MMBT5551LT1-NPN-SOT23-BEC  [SOT23-BEC]
Q17  MMBT5401  BC857B-PNP-SOT23-BEC  [SOT23-BEC]
Q18  MMBT5551  MMBT5551LT1-NPN-SOT23-BEC  [SOT23-BEC]
Q19  MMBT5551  MMBT5551LT1-NPN-SOT23-BEC  [SOT23-BEC]
R86  10K  R-EU_R0805  [R0805]
R87  330R  R-EU_R0805  [R0805]
R88  5K1  R-EU_R0805  [R0805]
R89  47K  R-EU_R0805  [R0805]
R90  47K  R-EU_R0805  [R0805]
R91  47K  R-EU_R0805  [R0805]
R92  5K6  R-EU_R0805  [R0805]
R93  750R  R-EU_R0805  [R0805]
R94  2K2  R-EU_R0805  [R0805]
R95  1K  R-EU_R0805  [R0805]
R96  2K2  R-EU_R0805  [R0805]
R97  5K6  R-EU_R0805  [R0805]
R98  10K  R-EU_R0805  [R0805]
R99  10K  R-EU_R0805  [R0805]
R100  750R  R-EU_R0805  [R0805]
R101  5K1  R-EU_R0805  [R0805]
R102  4K7  R-EU_R0805  [R0805]
R103  47K  R-EU_R0805  [R0805]
R104  5K6  R-EU_R0805  [R0805]
R105  330R  R-EU_R0805  [R0805]
R106  10K  R-EU_R0805  [R0805]

### Nets
+5V: R88.2 R98.2 R101.2 ; also sheet 2,3,4,6,7,8,9,10,11
CC_ACTIVE: R101.1 R104.2 ; also sheet 4
CV_ACTIVE: R88.1 R92.2 ; also sheet 4
GND [gnd]: C82.1 C83.1 Q16.E Q18.E R90.1 R94.1 R97.2 R103.1 ; supply symbol labelled PGND ; also sheet 1,2,3,4,6,7,8,9,10,11
I_SERVO: R106.1 ; also sheet 3
N$25: C80.2 Q17.B R87.1 R93.2 R96.2
N$39: Q18.B R99.1 R103.2
N$40: C81.2 Q17.C R91.1 R99.2
N$45: IC15.1(A:OUT) IC15.2(B:OUT) R92.1
N$47: Q19.C R95.1
N$48: IC15.13(D:OUT) IC15.14(C:OUT) R104.1
N$49: C84.1 Q19.B R100.1 R105.2
N$53: C81.1 Q16.B R90.2 R91.2
N$153: IC15.5(B:+IN) IC15.6(A:-IN) R86.2
N$161: IC15.8(C:-IN) IC15.11(D:+IN) R106.2
N$170: IC15.7(A:+IN) IC15.9(C:+IN) R89.1 R94.2
N$173: R95.2 R96.1
N$177: IC15.4(B:-IN) IC15.10(D:-IN) R97.1 R102.2
OUT+: C80.1 Q17.E R87.2 ; also sheet 1,3
OUT-: C84.2 Q19.E R105.1 ; also sheet 3
SENSE+: R93.1 ; also sheet 3
SENSE-: R100.2 ; also sheet 3
SENSE_ERR: Q18.C R98.1 ; also sheet 4
SENSE_PROT: Q16.C ; also sheet 3
U_SERVO: R86.1 ; also sheet 3
V+: C82.2 IC15.3(P:V+) R89.2 ; also sheet 2,3,4
V-: C83.2 IC15.12(P:GND) R102.1 ; also sheet 2,3,4

### Notes on the sheet
- Constant Voltage (CV) and Constant Current (CC) mode indicator | Remote sense reverse polarity detection
- +0.275V
- -2.32V
- CC/CV indicators, Sense error detection
- Licensed under the TAPR Open Hardware License (www.tapr.org/OHL)
- More info at http://www.envox.hr/eez
- Repository: https://github.com/eez-open

## Sheet 6 of 11: AC soft-start, +5V power
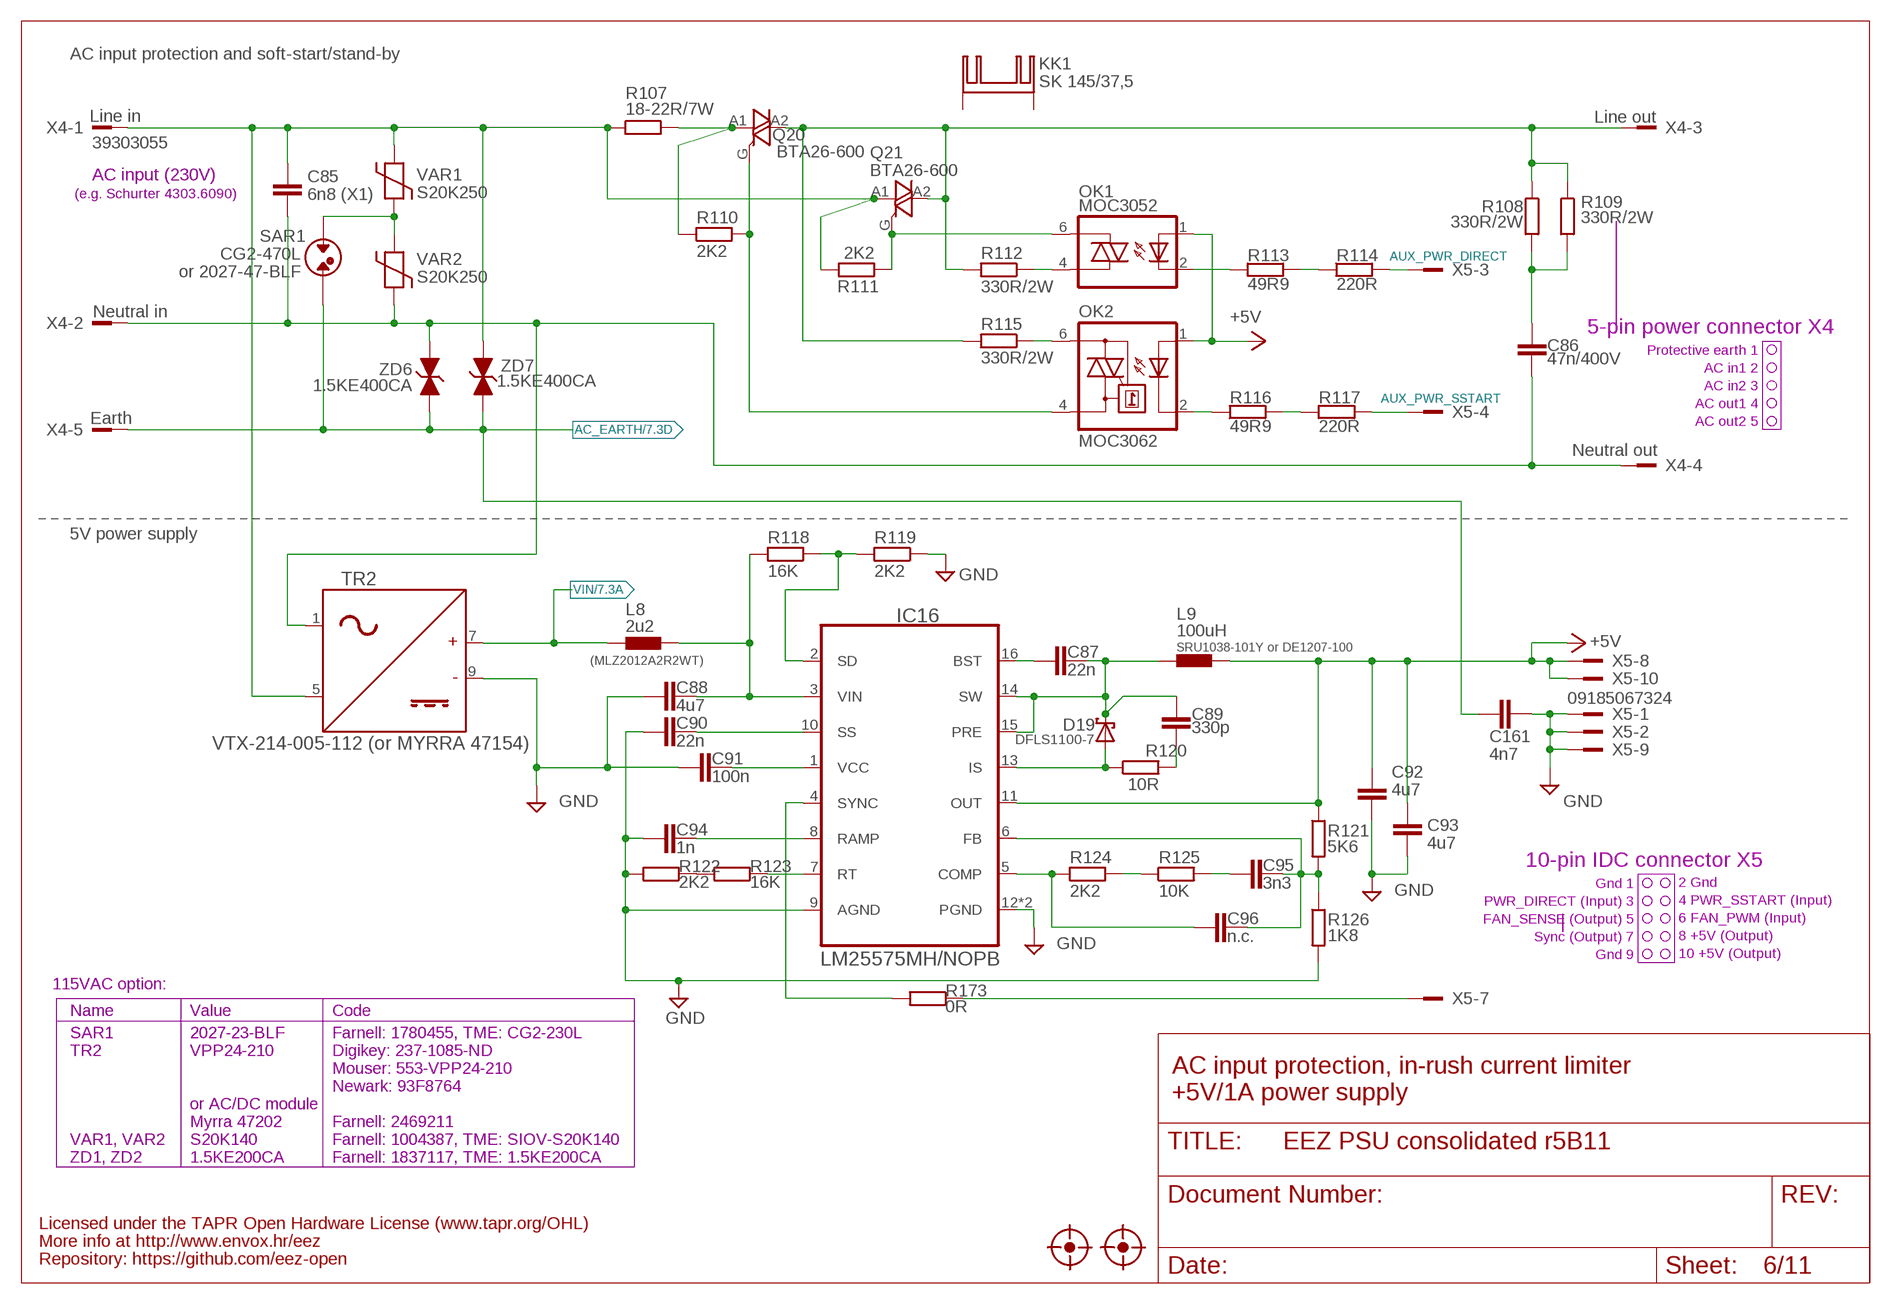
[diagram p5: schematic, sheet 6]

### Parts
C85  6n8 (X1)  C-EU102-064X133  [C102-064X133]
C86  47n/400V  C-EU075-052X106  [C075-052X106]
C87  22n  C-EUC0805  [C0805]
C88  4u7  C-EUC1210  [C1210]
C89  330p  C-EUC0805  [C0805]
C90  22n  C-EUC0805  [C0805]
C91  100n  C-EUC0603  [C0603]
C92  4u7  C-EUC1210  [C1210]
C93  4u7  C-EUC1210  [C1210]
C94  1n  C-EUC0805  [C0805]
C95  3n3  C-EUC0805  [C0805]
C96  n.c.  C-EUC0805  [C0805]
C161  4n7  C-EUC1210  [C1210]
D19  DFLS1100-7  SCHOTTKYSOD123  [SOD123]
FM3  FIDUCIAL_2  [FIDUCIAL_DUAL]
FM4  FIDUCIAL_2  [FIDUCIAL_DUAL]
IC16  LM25575MH/NOPB  LM(2)5575  [SOP65P640X110-17N]
KK1  SK 145/37,5  SK145  [SK145]
L8  2u2  L-EU0805  [0805]
L9  100uH  COILCRAFT_MSS1278  [MSS1278]
OK1  MOC3052  MOC305X  [DIL6-SMD]
OK2  MOC3062  MOC3033S  [DIL6-SMD]
Q20  BTA26-600  BTA26-V  [TOP3S-1]
Q21  BTA26-600  BTA26-V  [TOP3S-1]
R107  18-22R/7W  R_EU7W  [R_0913]
R108  330R/2W  R-EU_R2512  [R2512]
R109  330R/2W  R-EU_R2512  [R2512]
R110  2K2  R-EU_R0805  [R0805]
R111  2K2  R-EU_R0805  [R0805]
R112  330R/2W  R-EU_R2512  [R2512]
R113  49R9  R-EU_R0805  [R0805]
R114  220R  R-EU_R0805  [R0805]
R115  330R/2W  R-EU_R2512  [R2512]
R116  49R9  R-EU_R0805  [R0805]
R117  220R  R-EU_R0805  [R0805]
R118  16K  R-EU_R0805  [R0805]
R119  2K2  R-EU_R0805  [R0805]
R120  10R  R-EU_R1206  [R1206]
R121  5K6  R-EU_R0805  [R0805]
R122  2K2  R-EU_R0805  [R0805]
R123  16K  R-EU_R0805  [R0805]
R124  2K2  R-EU_R0805  [R0805]
R125  10K  R-EU_R0805  [R0805]
R126  1K8  R-EU_R0805  [R0805]
R173  0R  R-EU_R0805  [R0805]
SAR1  CG2-470L  SAR  [SAR]
TR2  VTX-214-005-112 (or MYRRA 47154)  AC_DC_ADAPTER_5W  [PCB_ACDC_MYRRA_5W]
VAR1  S20K250  VARISTOR  [VARISTOR]
VAR2  S20K250  VARISTOR  [VARISTOR]
X4  39303055  MINIFIT_6659-5  [MINIFIT_6659-5]
X5  09185067324  IDC-10PINBLACK  [IDC-10PIN]
ZD6  1.5KE400CA  1.5KE-BIDIR  [DO201-BIDIR]
ZD7  1.5KE400CA  1.5KE-BIDIR  [DO201-BIDIR]

### Nets
+5V: C92.1 C93.1 IC16.11(OUT) L9.2 OK1.1(A) OK2.1(A) R121.1 X5.8 X5.10 ; also sheet 2,3,4,5,7,8,9,10,11
AC_EARTH: C161.1 SAR1.P$2 X4.5 ZD6.C ZD7.C ; also sheet 7
AC_IN1_MAIN: C85.1 Q21.A1 R107.1 R111.2 TR2.5(IN2) VAR1.P$2 X4.1 ZD7.A
AC_IN2_MAIN: C85.2 C86.1 TR2.1(IN1) VAR2.P$1 X4.2 X4.4 ZD6.A
AUX_PWR_DIRECT: R114.2 X5.3
AUX_PWR_SSTART: R117.2 X5.4
AUX_SYNC: R173.1 X5.7
DC_PREG2: C88.1 IC16.3(VIN) L8.2 R118.2
GND [gnd]: C88.2 C90.2 C91.1 C92.2 C93.2 C94.1 C161.2 IC16.9(AGND) IC16.12(PGND) IC16.TP(PGND) R119.1 R122.2 R126.2 TR2.9(-) X5.1 X5.2 X5.9 ; also sheet 1,2,3,4,5,7,8,9,10,11
IS1: D19.A IC16.13(IS) R120.1
N$52: C95.2 R125.2
N$57: C95.1 C96.1 IC16.6(FB) R121.2 R126.1
N$58: C87.2 IC16.16(BST)
N$59: C96.2 IC16.5(COMP) R124.1
N$60: IC16.7(RT) R123.1
N$61: C91.2 IC16.1(VCC)
N$63: C94.2 IC16.8(RAMP)
N$66: C90.1 IC16.10(SS)
N$69: IC16.2(SD) R118.1 R119.2
N$70: C89.2 R120.2
N$71: OK1.6(A2) Q21.G R111.1
N$72: OK2.4(A1) Q20.G R110.2
N$73: OK2.6(A2) R115.1
N$74: R113.2 R114.1
N$75: R116.2 R117.1
N$76: OK1.4(A1) R112.1
N$81: Q20.A2 Q21.A2 R108.1 R109.1 R112.2 R115.2 X4.3
N$83: C86.2 R108.2 R109.2
N$114: SAR1.P$1 VAR1.P$1 VAR2.P$2
N$152: Q20.A1 R107.2 R110.1
N$169 [gnd]: R122.1 R123.2
N$171: R124.2 R125.1
N$174: OK2.2(C) R116.1
N$175: OK1.2(C) R113.1
N$181: IC16.4(SYNC) R173.2
SW2: C87.1 C89.1 D19.C IC16.14(SW) IC16.15(PRE) L9.1
VIN: L8.1 TR2.7(+) ; also sheet 7
Unconnected: KK1.1(K) KK1.2(K)

### Notes on the sheet
- AC input protection and soft-start/stand-by
- Line in
- Line out
- AC input (230V)
- (e.g. Schurter 4303.6090)
- or 2027-47-BLF
- Neutral in
- 5-pin power connector X4
- Protective earth 1
- AC in1 2
- AC in2 3
- AC out1 4
- Earth
- AC out2 5
- Neutral out
- 5V power supply
- SRU1038-101Y or DE1207-100
- (MLZ2012A2R2WT)
- 10-pin IDC connector X5
- Gnd 1
- 2 Gnd
- PWR_DIRECT (Input) 3
- 4 PWR_SSTART (Input)
- FAN_SENSE (Output) 5
- 6 FAN_PWM (Input)
- Sync (Output) 7
- 8 +5V (Output)
- Gnd 9
- 10 +5V (Output)
- 115VAC option:
- Name | Value | Code
- SAR1 | 2027-23-BLF | Farnell: 1780455, TME: CG2-230L
- TR2 | VPP24-210 | Digikey: 237-1085-ND
- Mouser: 553-VPP24-210 | AC input protection, in-rush current limiter
- Newark: 93F8764
- +5V/1A power supply
- or AC/DC module
- Myrra 47202 | Farnell: 2469211
- VAR1, VAR2 | S20K140 | Farnell: 1004387, TME: SIOV-S20K140
- ZD1, ZD2 | 1.5KE200CA | Farnell: 1837117, TME: 1.5KE200CA
- Licensed under the TAPR Open Hardware License (www.tapr.org/OHL)
- More info at http://www.envox.hr/eez
- Repository: https://github.com/eez-open

## Sheet 7 of 11: Ethernet, USB, Fan
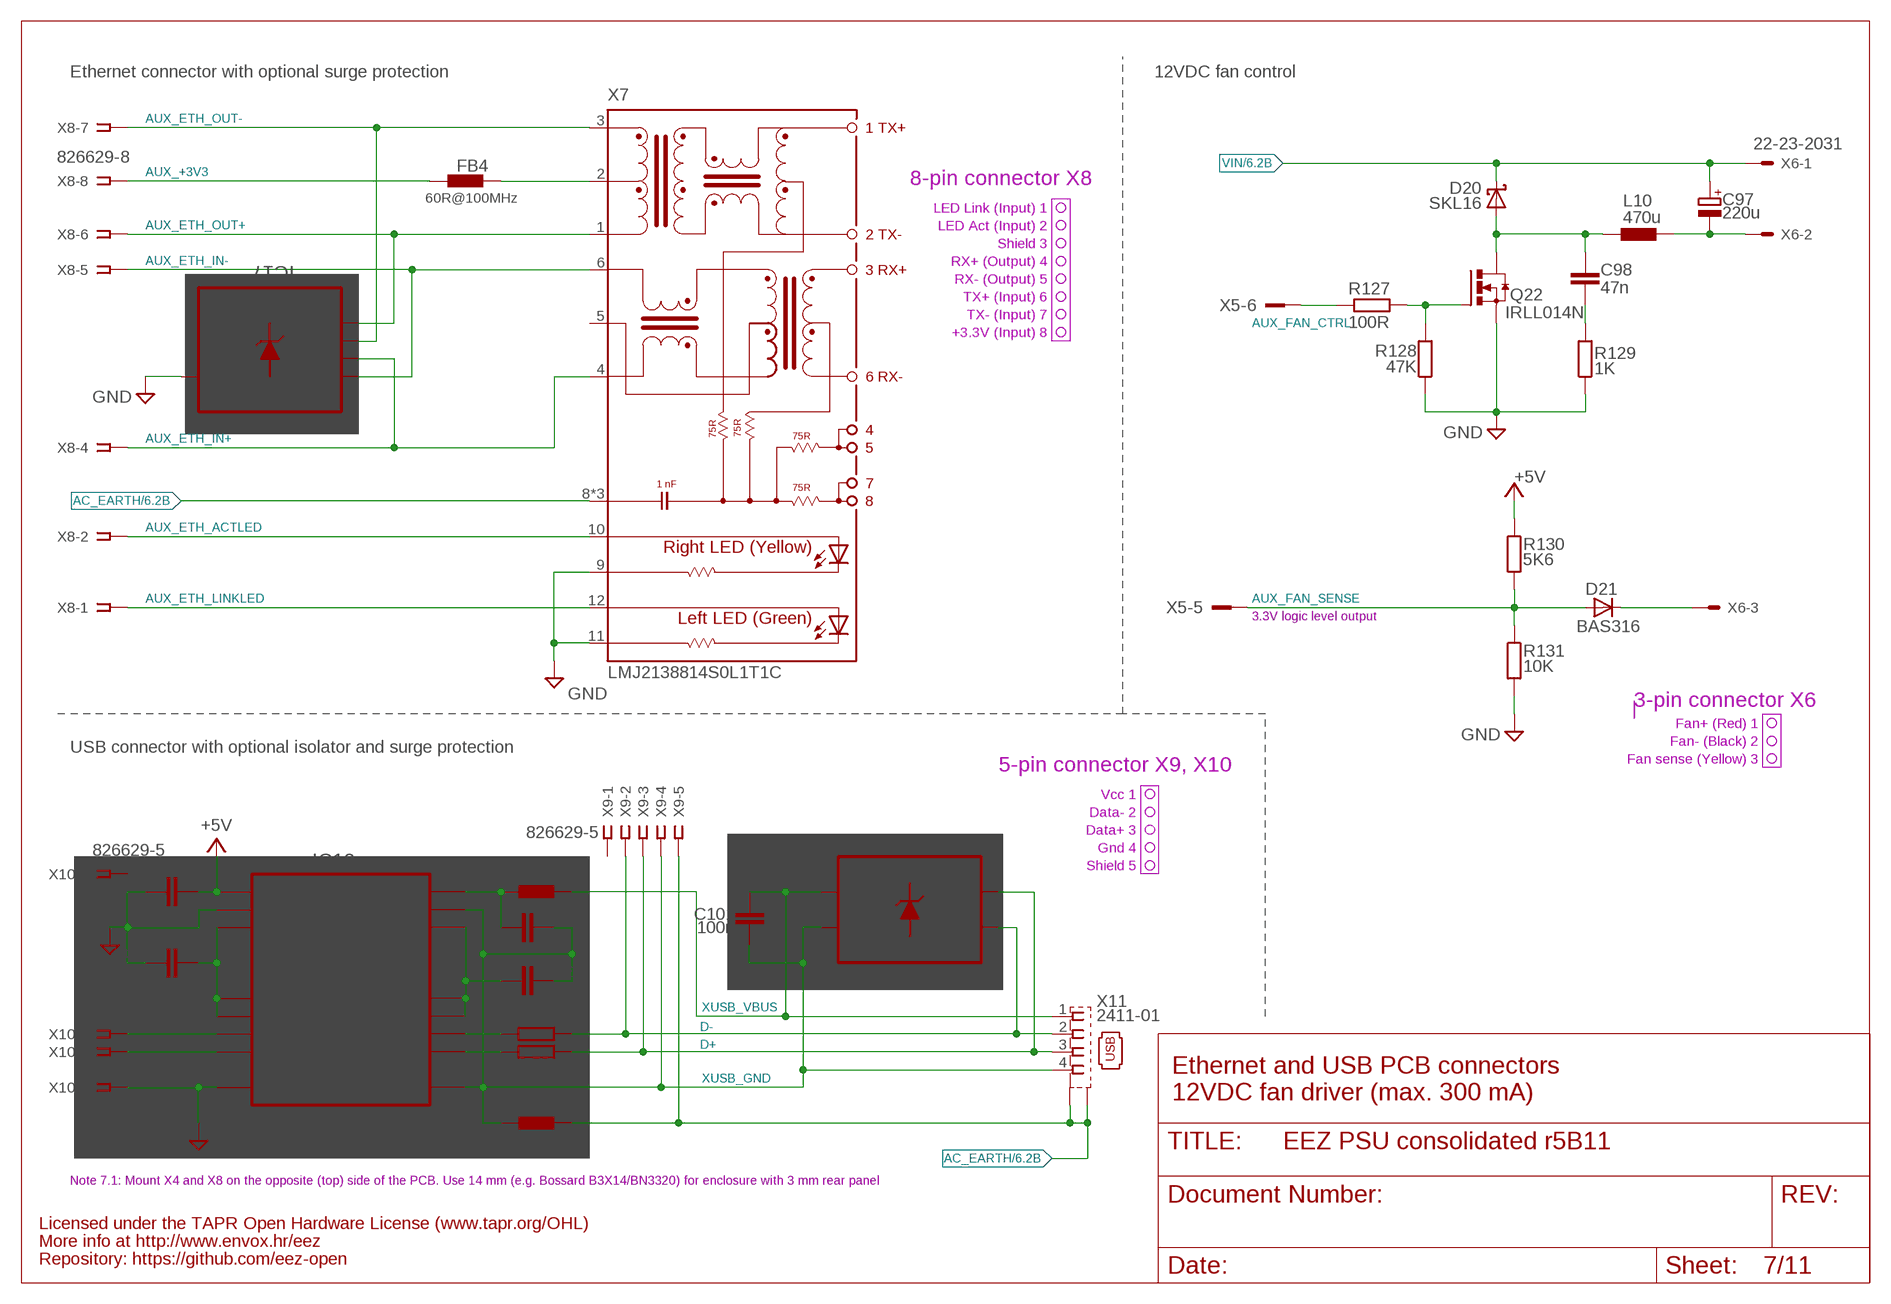
[diagram p6: schematic, sheet 7]

### Parts
C97  220u  ECAPPANASONIC_H  [CAPAE660X610N]
C98  47n  C-EUC0805  [C0805]
C99  100n  C-EUC0603  [C0603]
C100  100n  C-EUC0603  [C0603]
C101  100n  C-EUC0603  [C0603]
C102  100n  C-EUC0603  [C0603]
C103  100n  C-EUC0603  [C0603]
D20  SKL16  SCHOTTKYSOD123  [SOD123]
D21  BAS316  DIODE-SOD323-W  [SOD323-W]
FB4  60R@100MHz  FERRITE_BEAD0603  [BEAD0603]
FB5  60R@100MHz  FERRITE_BEAD0603  [BEAD0603]
FB6  60R@100MHz  FERRITE_BEAD0603  [BEAD0603]
IC17  TPD4E002DRLR  [SOT50P280X60-5N]
IC18  TPD2E001DZDR  [SOP192P292X122-4N]
IC19  ADUM3160BRWZ  ADUM3160BRWZWIDE  [SOIC-16W]
L10  470u  DE0704  [DE0704]
Q22  IRLL014N  N-HEXFET-2D_SOT232-IRLL014N  [SOT223]
R127  100R  R-EU_R0805  [R0805]
R128  47K  R-EU_R0805  [R0805]
R129  1K  R-EU_R0805  [R0805]
R130  5K6  R-EU_R0805  [R0805]
R131  10K  R-EU_R0805  [R0805]
R132  22R  R-EU_R0805  [R0805]
R133  22R  R-EU_R0805  [R0805]
X6  22-23-2031  [22-23-2031]
X7  LMJ2138814S0L1T1C  RJ45-VERTLMJ2138814S0L1T1C  [RJ45-VERT]
X8  826629-8  SSW-108-02-S-S  [SSW-108-02-S-S]
X9  826629-5  SSW-105-02-S-S  [SSW-105-02-S-S]
X10  826629-5  SSW-105-02-S-S  [SSW-105-02-S-S]
X11  2411-01  KUSBVX-BS1N  [KUSBVX-BS1N]

### Nets
+5V: C99.1 IC19.16(VBUS2) R130.1 ; also sheet 2,3,4,5,6,8,9,10,11
AC_EARTH: FB6.P$1 X7.8(SH) X7.SH1(SH) X7.SH2(SH) X9.5 X11.M1(S1) X11.M2(S2) ; also sheet 6
AUX_+3V3: FB4.P$2 X8.8
AUX_ETH_ACTLED: X7.10(YELLOW_A) X8.2
AUX_ETH_IN+: IC17.4(IO3) X7.4(RD-) X8.4
AUX_ETH_IN-: IC17.5(IO4) X7.6(RD+) X8.5
AUX_ETH_LINKLED: X7.12(GREEN-A) X8.1
AUX_ETH_OUT+: IC17.1(IO1) X7.1(TD-) X8.6
AUX_ETH_OUT-: IC17.3(IO2) X7.3(TD+) X8.7
AUX_FAN_CTRL: R127.2 X5.6
AUX_FAN_SENSE: D21.A R130.2 R131.1 X5.5
D+: IC18.2(IO1) R133.1 X9.3 X11.3
D-: IC18.3(IO2) R132.1 X9.2 X11.2
FAN_OUT: C98.2 D20.A L10.2 Q22.2(D) Q22.4(D)
GND [gnd]: C99.2 C102.2 IC17.2(GND) IC19.9(GND2) IC19.15(GND2_2) Q22.3(S) R128.1 R129.1 R131.2 X7.9(YELLOW-C) X7.11(GREEN-C) X10.4 ; supply symbol labelled PGND ; also sheet 1,2,3,4,5,6,8,9,10,11
MCU_D+: IC19.10(DD+) X10.3
MCU_D-: IC19.11(DD-) X10.2
N$84: C98.1 R129.2
N$85: Q22.1(G) R127.1 R128.2
N$86: C97.2(-) L10.1 X6.2
N$87: C103.1 IC19.3(VDD1) IC19.4(PDEN) IC19.5(SPU)
N$88: IC19.6(UD-) R132.2
N$89: IC19.7(UD+) R133.2
N$90: C100.1 FB5.P$2 IC19.1(VBUS1)
N$91: C102.1 IC19.12(PIN) IC19.13(SPD) IC19.14(VDD2)
N$125: FB4.P$1 X7.2(CT)
N$163: D21.C X6.3
VIN: C97.1(+) D20.C X6.1 ; also sheet 6
XUSB_GND: C100.2 C101.1 C103.2 FB6.P$2 IC18.1(GND) IC19.2(GND1_2) IC19.8(GND1) X9.4 X11.4
XUSB_VBUS: C101.2 FB5.P$1 IC18.4(VCC) X11.1
Unconnected: X7.5(CR) X8.3 X9.1 X10.1 X10.5

### Notes on the sheet
- Ethernet connector with optional surge protection | 12VDC fan control
- 8-pin connector X8
- LED Link (Input) 1
- LED Act (Input) 2
- Shield 3
- RX+ (Output) 4
- RX- (Output) 5
- TX+ (Input) 6
- TX- (Input) 7
- +3.3V (Input) 8
- 3.3V logic level output
- 3-pin connector X6
- Fan+ (Red) 1
- Fan- (Black) 2
- USB connector with optional isolator and surge protection
- Fan sense (Yellow) 3
- 5-pin connector X9, X10
- Vcc 1
- Data- 2
- Data+ 3
- Gnd 4
- Shield 5
- Ethernet and USB PCB connectors
- 12VDC fan driver (max. 300 mA)
- Note 7.1: Mount X4 and X8 on the opposite (top) side of the PCB. Use 14 mm (e.g. Bossard B3X14/BN3320) for enclosure with 3 mm rear panel
- Licensed under the TAPR Open Hardware License (www.tapr.org/OHL)
- More info at http://www.envox.hr/eez
- Repository: https://github.com/eez-open

## Sheet 8 of 11: Binding posts relays, LED driver
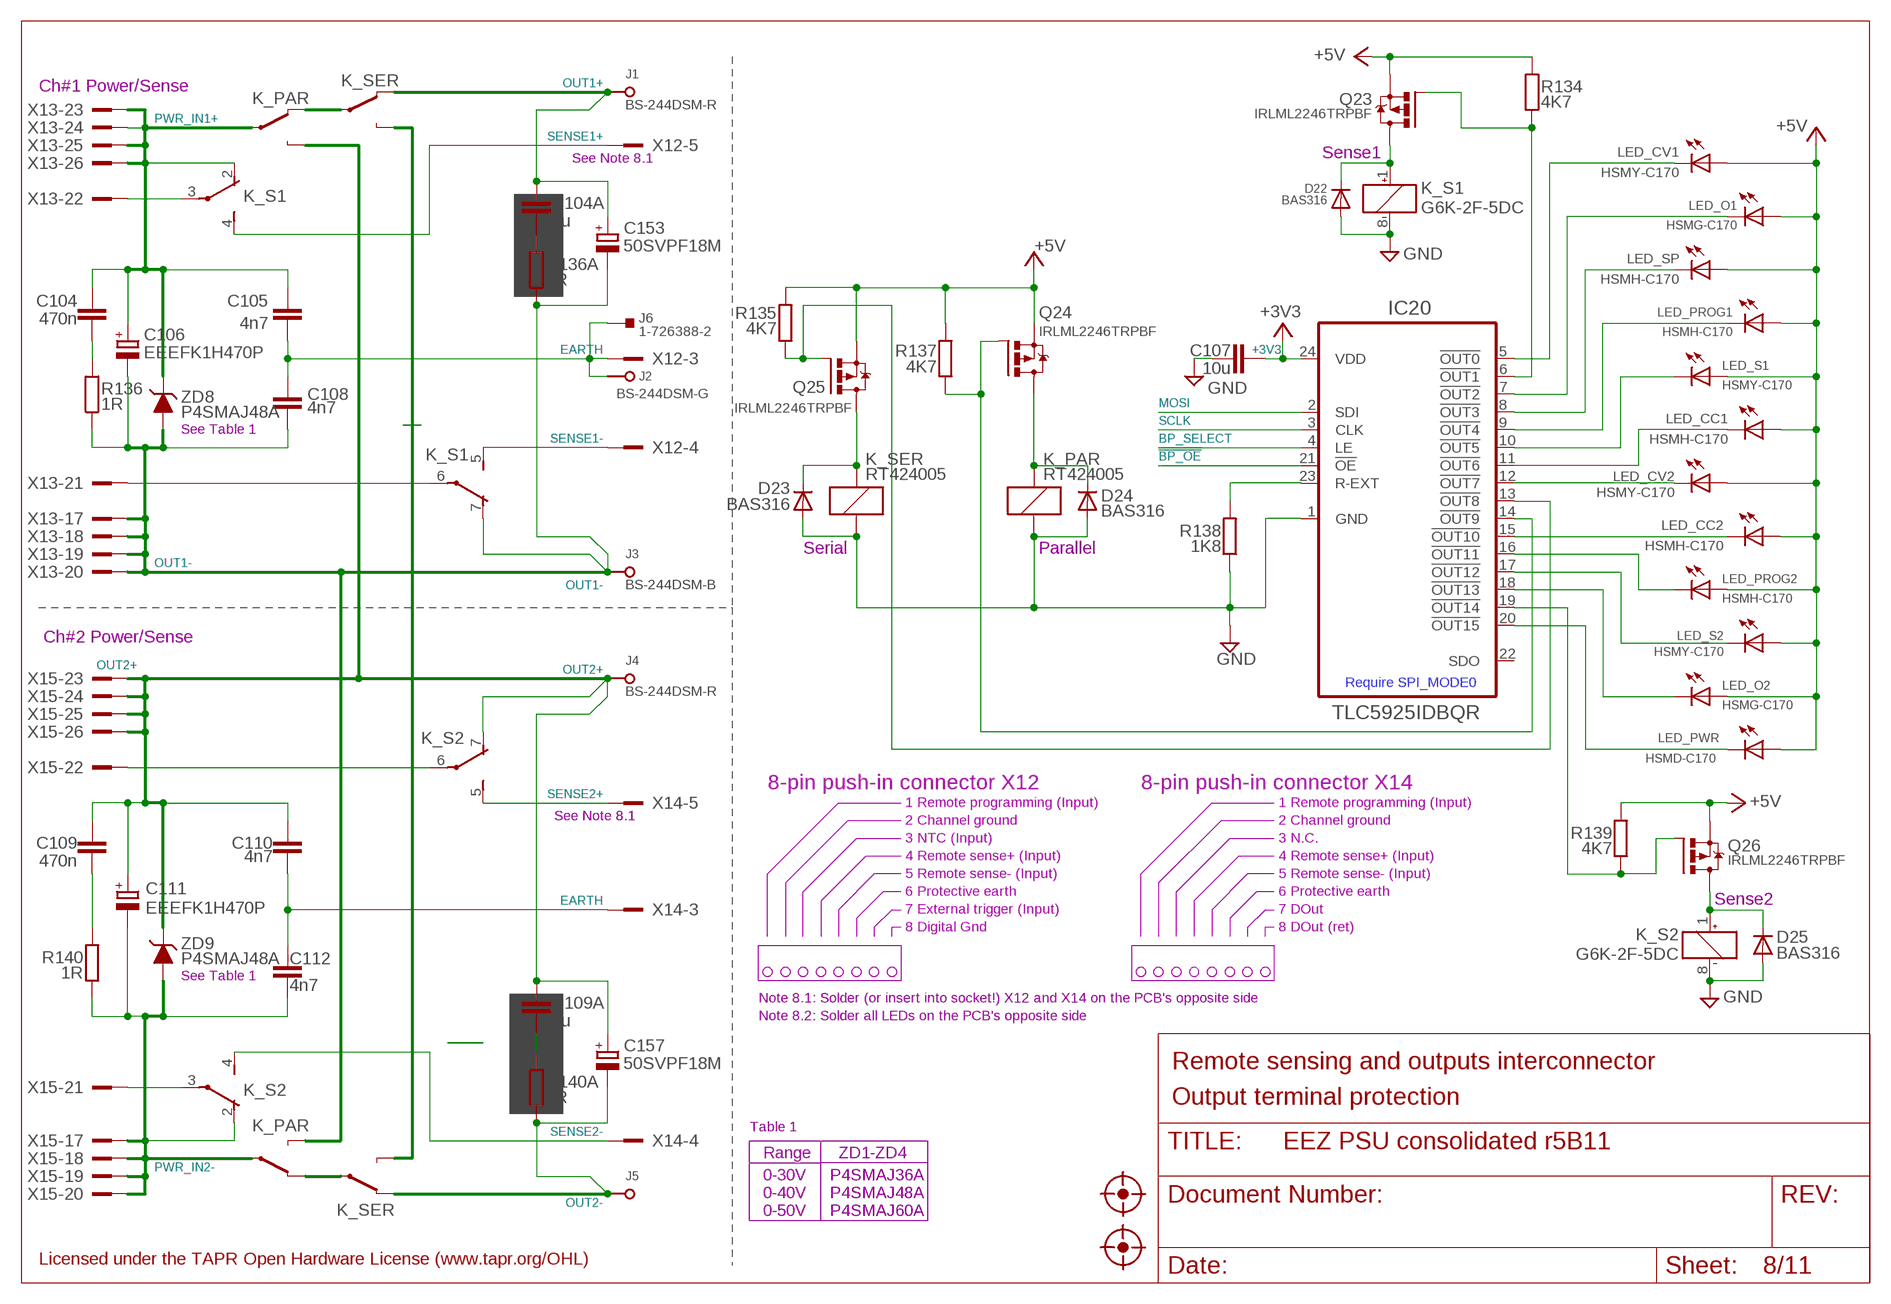
[diagram p7: schematic, sheet 8]

### Parts
C104  470n  C-EUC0805  [C0805]
C104A  1u  C-EUC0805  [C0805]
C105  4n7  C-EUC1210  [C1210]
C106  EEEFK1H470P  EEE-FK1J220P-CASE-E  [CAPAE830X650N]
C107  10u  C-EUC1210  [C1210]
C108  4n7  C-EUC1210  [C1210]
C109  470n  C-EUC0805  [C0805]
C109A  1u  C-EUC0805  [C0805]
C110  4n7  C-EUC1210  [C1210]
C111  EEEFK1H470P  EEE-FK1J220P-CASE-E  [CAPAE830X650N]
C112  4n7  C-EUC1210  [C1210]
C153  50SVPF18M  EEE-FK1J220P-CASE-E  [CAPAE830X650N]
C157  50SVPF18M  EEE-FK1J220P-CASE-E  [CAPAE830X650N]
D22  BAS316  DIODE-SOD323-W  [SOD323-W]
D23  BAS316  DIODE-SOD323-W  [SOD323-W]
D24  BAS316  DIODE-SOD323-W  [SOD323-W]
D25  BAS316  DIODE-SOD323-W  [SOD323-W]
FM5  FIDUCIAL_2  [FIDUCIAL_DUAL]
FM6  FIDUCIAL_2  [FIDUCIAL_DUAL]
IC20  TLC5925IDBQR  [SOP63P600X175-24N]
J1  BS-244DSM-R  BINDING_POST-2  [BP_5_12]
J2  BS-244DSM-G  BINDING_POST-2  [BP_5_12]
J3  BS-244DSM-B  BINDING_POST-2  [BP_5_12]
J4  BS-244DSM-R  BINDING_POST-2  [BP_5_12]
J5  BS-244DSM-B  BINDING_POST-2  [BP_5_12]
J6  1-726388-2  PCB_TAB4.8MM  [PCB_TAB-4.8MM]
K_PAR  RT424005  RELAY_RT314012-2  [RT-C/016A5_ROUND]
K_S1  G6K-2F-5DC  G6K-2F  [G6K-2F]
K_S2  G6K-2F-5DC  G6K-2F  [G6K-2F]
K_SER  RT424005  RELAY_RT314012-2  [RT-C/016A5_ROUND]
LED_CC1  HSMH-C170  LEDHSMH-C170  [LED_HSMH-C170]
LED_CC2  HSMH-C170  LEDHSMH-C170  [LED_HSMH-C170]
LED_CV1  HSMY-C170  LED0805  [LED_0805]
LED_CV2  HSMY-C170  LED0805  [LED_0805]
LED_O1  HSMG-C170  LED0805  [LED_0805]
LED_O2  HSMG-C170  LED0805  [LED_0805]
LED_PROG1  HSMH-C170  LEDHSMH-C170  [LED_HSMH-C170]
LED_PROG2  HSMH-C170  LEDHSMH-C170  [LED_HSMH-C170]
LED_PWR  HSMD-C170  LED0805  [LED_0805]
LED_S1  HSMY-C170  LED0805  [LED_0805]
LED_S2  HSMY-C170  LED0805  [LED_0805]
LED_SP  HSMH-C170  LEDHSMH-C170  [LED_HSMH-C170]
Q23  IRLML2246TRPBF  [SOT95P237X112-3N]
Q24  IRLML2246TRPBF  [SOT95P237X112-3N]
Q25  IRLML2246TRPBF  [SOT95P237X112-3N]
Q26  IRLML2246TRPBF  [SOT95P237X112-3N]
R134  4K7  R-EU_R0805  [R0805]
R135  4K7  R-EU_R0805  [R0805]
R136  1R  R-EU_R0805  [R0805]
R136A  1R  R-EU_R0805  [R0805]
R137  4K7  R-EU_R0805  [R0805]
R138  1K8  R-EU_R0805  [R0805]
R139  4K7  R-EU_R0805  [R0805]
R140  1R  R-EU_R0805  [R0805]
R140A  1R  R-EU_R0805  [R0805]
X12  MC000006  MC000006MIRROR  [MC000006_MIRROR]
X13  TSW-113-07-F-D  [TSW-113-07-F-D]
X14  MC000006  MC000006MIRROR  [MC000006_MIRROR]
X15  TSW-113-07-F-D  [TSW-113-07-F-D]
ZD8  P4SMAJ48A  PSMAXX  [DO214AC]
ZD9  P4SMAJ48A  PSMAXX  [DO214AC]

### Nets
!BP_OE: IC20.21(!OE) ; also sheet 9
!BP_OUT0: IC20.5(!OUT0) LED_CV1.C
!BP_OUT1: IC20.6(!OUT1) Q23.1(G) R134.1
!BP_OUT2: IC20.7(!OUT2) LED_O1.C
!BP_OUT3: IC20.8(!OUT3) LED_SP.C
!BP_OUT4: IC20.9(!OUT4) LED_PROG1.C
!BP_OUT5: IC20.10(!OUT5) LED_S1.C
!BP_OUT6: IC20.11(!OUT6) LED_CC1.C
!BP_OUT7: IC20.12(!OUT7) LED_CV2.C
!BP_OUT8: IC20.13(!OUT8) Q25.1(G) R135.1
!BP_OUT9: IC20.14(!OUT9) Q24.1(G) R137.1
!BP_OUT10: IC20.15(!OUT10) LED_CC2.C
!BP_OUT12: IC20.17(!OUT12) LED_S2.C
!BP_OUT13: IC20.18(!OUT13) LED_O2.C
!BP_OUT14: IC20.19(!OUT14) Q26.1(G) R139.1
!BP_OUT15: IC20.20(!OUT15) LED_PWR.C
+3V3: C107.1 IC20.24(VDD) ; also sheet 9,10,11
+5V: LED_CC1.A LED_CC2.A LED_CV1.A LED_CV2.A LED_O1.A LED_O2.A LED_PROG1.A LED_PROG2.A LED_PWR.A LED_S1.A LED_S2.A LED_SP.A Q23.2(S) Q24.2(S) Q25.2(S) Q26.2(S) R134.2 R135.2 R137.2 R139.2 ; also sheet 2,3,4,5,6,7,9,10,11
BP_SELECT: IC20.4(LE) ; also sheet 9
EARTH: C105.2 C108.1 C110.2 C112.1 J2.P$1 J6.P$1 J6.P$2 X12.3 X12.3.1 X14.3 X14.3.1 ; also sheet 1,10
GND [gnd]: C107.2 D22.A D23.A D24.A D25.A IC20.1(GND) K_PAR.A1(K:C2) K_S1.8(1:-) K_S2.8(1:-) K_SER.A1(K:C2) R138.1 ; also sheet 1,2,3,4,5,6,7,9,10,11
MOSI: IC20.2(SDI) ; also sheet 9,10
N$92: D22.C K_S1.1(1:+) Q23.3(D)
N$93: D25.C K_S2.1(1:+) Q26.3(D)
N$94: C104.2 R136.2
N$95: C109.2 R140.2
N$96: IC20.16(!OUT11) LED_PROG2.C
N$97: K_SER.14A(-1:O) K_SER.14B(-2:O)
N$98: K_PAR.12A(-1:S) K_SER.11B(-2:P)
N$99: K_PAR.12B(-2:S) K_SER.11A(-1:P)
N$155: D23.C K_SER.A2(K:C1) Q25.3(D)
N$156: D24.C K_PAR.A2(K:C1) Q24.3(D)
N$176: C104A.2 R136A.2
N$178: C109A.2 R140A.2
N$306: IC20.23(R-EXT) R138.2
OUT1+: C104A.1 C153.1 J1.P$1 K_SER.12B(-2:S)
OUT1-: C106.2 C108.2 C153.2 J3.P$1 K_PAR.14B(-2:O) K_S1.7(3:O) R136.1 R136A.1 X13.17 X13.18 X13.19 X13.20 ZD8.A
OUT2+: C109.1 C109A.1 C110.1 C111.1 C157.1 J4.P$1 K_PAR.14A(-1:O) K_S2.7(3:O) X15.23 X15.24 X15.25 X15.26 ZD9.C
OUT2-: C157.2 J5.P$1 K_SER.12A(-1:S) R140A.1
PWR_IN1+: C104.1 C105.1 C106.1 K_PAR.11A(-1:P) K_S1.2(2:O) X13.23 X13.24 X13.25 X13.26 ZD8.C
PWR_IN2-: C111.2 C112.2 K_PAR.11B(-2:P) K_S2.2(2:O) R140.1 X15.17 X15.18 X15.19 X15.20 ZD9.A
SCLK: IC20.3(CLK) ; also sheet 9,10
SENSE1+: K_S1.4(2:S) X12.5 X12.5.1
SENSE1-: K_S1.5(3:S) X12.4 X12.4.1
SENSE1_IN+: K_S1.3(2:P) X13.22
SENSE1_IN-: K_S1.6(3:P) X13.21
SENSE2+: K_S2.5(3:S) X14.5 X14.5.1
SENSE2-: K_S2.4(2:S) X14.4 X14.4.1
SENSE2_IN+: K_S2.6(3:P) X15.22
SENSE2_IN-: K_S2.3(2:P) X15.21
Unconnected: IC20.22(SDO) X14.6 X14.6.1

### Notes on the sheet
- Ch#1 Power/Sense
- Sense1
- See Note 8.1
- See Table 1
- Serial | Parallel
- Ch#2 Power/Sense
- Require SPI_MODE0
- 8-pin push-in connector X12 | 8-pin push-in connector X14
- 1 Remote programming (Input) | 1 Remote programming (Input)
- See Note 8.1
- 2 Channel ground | 2 Channel ground
- 3 NTC (Input) | 3 N.C.
- 4 Remote sense+ (Input) | 4 Remote sense+ (Input)
- 5 Remote sense- (Input) | 5 Remote sense- (Input)
- 6 Protective earth | 6 Protective earth
- Sense2
- 7 External trigger (Input) | 7 DOut
- 8 Digital Gnd | 8 DOut (ret)
- See Table 1
- Note 8.1: Solder (or insert into socket!) X12 and X14 on the PCB's opposite side
- Note 8.2: Solder all LEDs on the PCB's opposite side
- Remote sensing and outputs interconnector
- Output terminal protection
- Table 1
- Range | ZD1-ZD4
- 0-30V | P4SMAJ36A
- 0-40V | P4SMAJ48A
- 0-50V | P4SMAJ60A
- Licensed under the TAPR Open Hardware License (www.tapr.org/OHL)

## Sheet 9 of 11: Isolators, Arduino
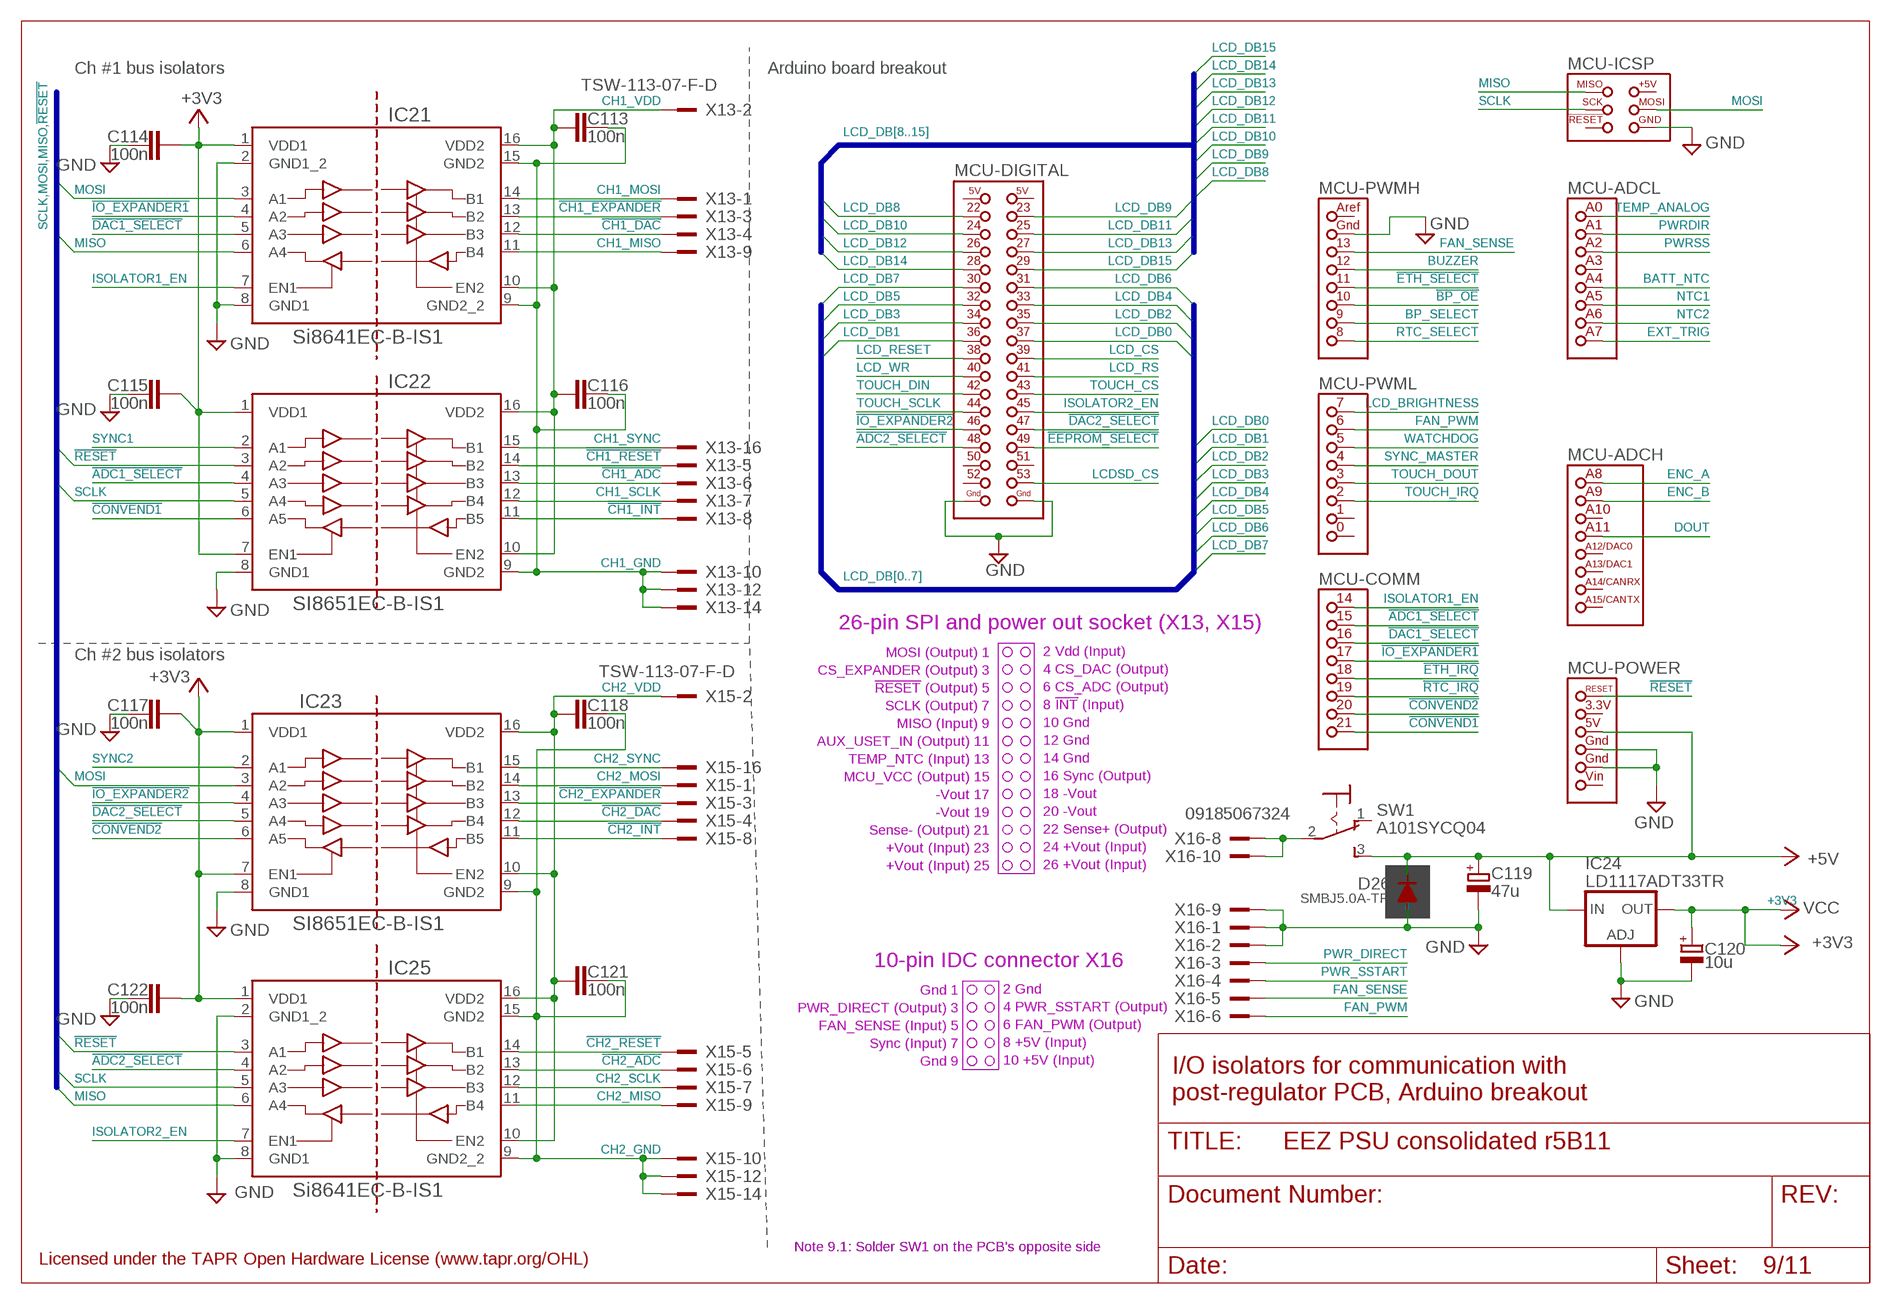
[diagram p8: schematic, sheet 9]

### Parts
C113  100n  C-EUC0603  [C0603]
C114  100n  C-EUC0603  [C0603]
C115  100n  C-EUC0603  [C0603]
C116  100n  C-EUC0603  [C0603]
C117  100n  C-EUC0603  [C0603]
C118  100n  C-EUC0603  [C0603]
C119  47u  ECAPPANASONIC_H  [CAPAE660X610N]
C120  10u  ECAPPANASONIC_C  [PANASONIC_C]
C121  100n  C-EUC0603  [C0603]
C122  100n  C-EUC0603  [C0603]
D26  SMBJ5.0A-TR  DIODEDO214AA  [DO214AA]
IC21  Si8641EC-B-IS1  SI8641NSOIC-16  [SOIC-16]
IC22  SI8651EC-B-IS1  SI8651NSOIC-16  [SOIC-16]
IC23  SI8651EC-B-IS1  SI8651NSOIC-16  [SOIC-16]
IC24  LD1117ADT33TR  LD117ADT33TR  [DPACK]
IC25  Si8641EC-B-IS1  SI8641NSOIC-16  [SOIC-16]
MCU  Arduino Due  ARDUINO_MEGA+ICSPMIRROR  [ARDUINO+ICSP_MIRROR]
SW1  A101SYCQ04  M9040P  [M9040P]
X16  09185067324  IDC-10PINBLACK  [IDC-10PIN]

### Nets
!ADC1_SELECT: IC22.4(A3) MCU.15
!ADC2_SELECT: IC25.4(A2) MCU.48(-DIGITAL:48(PL3))
!BP_OE: MCU.10 ; also sheet 8
!CH1_ADC: IC22.13(B3) X13.6
!CH1_DAC: IC21.12(B3) X13.4
!CH1_EXPANDER: IC21.13(B2) X13.3
!CH1_INT: IC22.11(B5) X13.8
!CH1_RESET: IC22.14(B2) X13.5
!CH2_ADC: IC25.13(B2) X15.6
!CH2_DAC: IC23.12(B4) X15.4
!CH2_EXPANDER: IC23.13(B3) X15.3
!CH2_INT: IC23.11(B5) X15.8
!CH2_RESET: IC25.14(B1) X15.5
!CONVEND1: IC22.6(A5) MCU.21
!CONVEND2: IC23.6(A5) MCU.20
!DAC1_SELECT: IC21.5(A3) MCU.16
!DAC2_SELECT: IC23.5(A4) MCU.47(-DIGITAL:47(PL4))
!EEPROM_SELECT: MCU.49(-DIGITAL:49(PL2)) ; also sheet 10
!ETH_IRQ: MCU.18 ; also sheet 10
!ETH_SELECT: MCU.11 ; also sheet 10
!IO_EXPANDER1: IC21.4(A2) MCU.17
!IO_EXPANDER2: IC23.4(A3) MCU.46(-DIGITAL:46(PL5))
!RESET: IC22.3(A2) IC25.3(A1) MCU.RESET(-POWER:!RESET) ; also sheet 10,11
!RTC_IRQ: MCU.19 ; also sheet 10
+3V3: C114.1 C115.1 C117.1 C120.1(+) C122.1 IC21.1(VDD1) IC22.1(VDD1) IC22.7(EN1) IC23.1(VDD1) IC23.7(EN1) IC24.4(OUT) IC25.1(VDD1) ; supply symbol labelled VCC ; also sheet 8,10,11
+5V: C119.1(+) D26.C IC24.3(IN) MCU.5V(-POWER:5V) SW1.3(S) ; also sheet 2,3,4,5,6,7,8,10,11
BATT_NTC: MCU.A4(-ADCL:ADC4) ; also sheet 11
BP_SELECT: MCU.9(-PWMH:9(PH6)) ; also sheet 8
BUZZER: MCU.12 ; also sheet 10
CH1_GND: C113.2 C116.2 IC21.9(GND2_2) IC21.15(GND2) IC22.9(GND2) X13.10 X13.12 X13.14 ; also sheet 11
CH1_MISO: IC21.11(B4) X13.9
CH1_MOSI: IC21.14(B1) X13.1
CH1_SCLK: IC22.12(B4) X13.7
CH1_SYNC: IC22.15(B1) X13.16
CH1_VDD: C113.1 C116.1 IC21.10(EN2) IC21.16(VDD2) IC22.10(EN2) IC22.16(VDD2) X13.2 ; also sheet 11
CH2_GND: C118.2 C121.2 IC23.9(GND2) IC25.9(GND2_2) IC25.15(GND2) X15.10 X15.12 X15.14 ; also sheet 11
CH2_MISO: IC25.11(B4) X15.9
CH2_MOSI: IC23.14(B2) X15.1
CH2_SCLK: IC25.12(B3) X15.7
CH2_SYNC: IC23.15(B1) X15.16
CH2_VDD: C118.1 C121.1 IC23.10(EN2) IC23.16(VDD2) IC25.10(EN2) IC25.16(VDD2) X15.2
DOUT: MCU.A11(-ADCH:ADC11) ; also sheet 11
ENC_A: MCU.A8(-ADCH:ADC8) ; also sheet 11
ENC_B: MCU.A9(-ADCH:ADC9) ; also sheet 11
EXT_TRIG: MCU.A7(-ADCL:ADC7) ; also sheet 11
FAN_PWM: MCU.6(-PWML:6(PH3)) X16.6
FAN_SENSE: MCU.13 X16.5
GND [gnd]: C114.2 C115.2 C117.2 C119.2(-) C120.2(-) C122.2 D26.A IC21.2(GND1_2) IC21.8(GND1) IC22.8(GND1) IC23.8(GND1) IC24.1(ADJ) IC25.2(GND1_2) IC25.8(GND1) MCU.GND1(-POWER:GND1) MCU.GND2(-POWER:GND2) MCU.GND3(-DIGITAL:GND3) MCU.GND4(-DIGITAL:GND4) MCU.GND(-PWMH:GND) MCU.ICSP_GND(-ICSP:GND) X16.1 X16.2 X16.9 ; also sheet 1,2,3,4,5,6,7,8,10,11
ISOLATOR1_EN: IC21.7(EN1) MCU.14
ISOLATOR2_EN: IC25.7(EN1) MCU.45(-DIGITAL:45(PL6))
LCD_BRIGHTNESS: MCU.7(-PWML:7(PH4)) ; also sheet 10
LCD_CS: MCU.39(-DIGITAL:39(PC0)) ; also sheet 10
LCD_DB0: MCU.37(-DIGITAL:37(PC2)) ; also sheet 10
LCD_DB1: MCU.36(-DIGITAL:36(PC3)) ; also sheet 10
LCD_DB2: MCU.35(-DIGITAL:35(PC4)) ; also sheet 10
LCD_DB3: MCU.34(-DIGITAL:34(PC5)) ; also sheet 10
LCD_DB4: MCU.33(-DIGITAL:33(PC6)) ; also sheet 10
LCD_DB5: MCU.32(-DIGITAL:32(PC7)) ; also sheet 10
LCD_DB6: MCU.31(-DIGITAL:31(PA7)) ; also sheet 10
LCD_DB7: MCU.30(-DIGITAL:30(PA6)) ; also sheet 10
LCD_DB8: MCU.22 ; also sheet 10
LCD_DB9: MCU.23 ; also sheet 10
LCD_DB10: MCU.24(-DIGITAL:24(PA0)) ; also sheet 10
LCD_DB11: MCU.25(-DIGITAL:25(PA1)) ; also sheet 10
LCD_DB12: MCU.26(-DIGITAL:26(PA2)) ; also sheet 10
LCD_DB13: MCU.27(-DIGITAL:27(PA3)) ; also sheet 10
LCD_DB14: MCU.28(-DIGITAL:28(PA4)) ; also sheet 10
LCD_DB15: MCU.29(-DIGITAL:29(PA5)) ; also sheet 10
LCD_RESET: MCU.38(-DIGITAL:38(PC1)) ; also sheet 10
LCD_RS: MCU.41(-DIGITAL:41(PG2)) ; also sheet 10
LCD_WR: MCU.40(-DIGITAL:40(PD7)) ; also sheet 10
LCDSD_CS: MCU.53(-DIGITAL:53(PB2/MOSI)) ; also sheet 10
MISO: IC21.6(A4) IC25.6(A4) MCU.ICSP_MISO(-ICSP:MISO) ; also sheet 10
MOSI: IC21.3(A1) IC23.3(A2) MCU.ICSP_MOSI(-ICSP:MOSI) ; also sheet 8,10
N$100: SW1.2(P) X16.8 X16.10
NTC1: MCU.A5(-ADCL:ADC5) ; also sheet 10
NTC2: MCU.A6(-ADCL:ADC6) ; also sheet 10
PWR_DIRECT: X16.3 ; also sheet 11
PWR_SSTART: X16.4 ; also sheet 11
PWRDIR: MCU.A1(-ADCL:ADC1) ; also sheet 11
PWRSS: MCU.A2(-ADCL:ADC2) ; also sheet 11
RTC_SELECT: MCU.8(-PWMH:8(PH5)) ; also sheet 10
SCLK: IC22.5(A4) IC25.5(A3) MCU.ICSP_SCK(-ICSP:SCK) ; also sheet 8,10
SYNC1: IC22.2(A1) ; also sheet 11
SYNC2: IC23.2(A1) ; also sheet 11
SYNC_MASTER: MCU.4(-PWML:4(PG5)) ; also sheet 11
TEMP_ANALOG: MCU.A0(-ADCL:ADC0) ; also sheet 10
TOUCH_CS: MCU.43(-DIGITAL:43(PG0)) ; also sheet 10
TOUCH_DIN: MCU.42(-DIGITAL:42(PG1)) ; also sheet 10
TOUCH_DOUT: MCU.3(-PWML:3(PE5)) ; also sheet 10
TOUCH_IRQ: MCU.2(-PWML:2(PE4)) ; also sheet 10
TOUCH_SCLK: MCU.44(-DIGITAL:44(PL7)) ; also sheet 10
WATCHDOG: MCU.5(-PWML:5(PE3)) ; also sheet 11
Unconnected: MCU.0(-PWML:0(PE0)) MCU.1(-PWML:1(PE1)) MCU.3.3V(-POWER:3V3) MCU.5V(1)(-DIGITAL:5V(1)) MCU.5V(2)(-DIGITAL:5V(2)) MCU.50(-DIGITAL:50(PL1/MISO)) MCU.51(-DIGITAL:51(PL0)) MCU.52(-DIGITAL:52(PB3/SCK)) MCU.A3(-ADCL:ADC3) MCU.A10(-ADCH:ADC10) MCU.A12(-ADCH:ADC12) MCU.A13(-ADCH:ADC13) MCU.A14(-ADCH:ADC14) MCU.A15(-ADCH:ADC15) MCU.AREF(-PWMH:AREF) MCU.ICSP_+5V(-ICSP:+5V) MCU.ICSP_RESET(-ICSP:!RESET) MCU.VIN(-POWER:VIN) SW1.1(O)

### Buses
SCLK,MOSI,MISO,!RESET
LCD_DB[8..15]
LCD_DB[0..7]

### Notes on the sheet
- Ch #1 bus isolators | Arduino board breakout
- 26-pin SPI and power out socket (X13, X15)
- MOSI (Output) 1
- 2 Vdd (Input)
- Ch #2 bus isolators
- CS_EXPANDER (Output) 3
- 4 CS_DAC (Output)
- !RESET! (Output) 5
- 6 CS_ADC (Output)
- SCLK (Output) 7
- 8 !INT! (Input)
- MISO (Input) 9
- 10 Gnd
- AUX_USET_IN (Output) 11
- 12 Gnd
- TEMP_NTC (Input) 13
- 14 Gnd
- MCU_VCC (Output) 15
- 16 Sync (Output)
- -Vout 17
- 18 -Vout
- -Vout 19
- 20 -Vout
- Sense- (Output) 21
- 22 Sense+ (Output)
- +Vout (Input) 23
- 24 +Vout (Input)
- +Vout (Input) 25
- 26 +Vout (Input)
- 10-pin IDC connector X16
- Gnd 1
- 2 Gnd
- PWR_DIRECT (Output) 3
- 4 PWR_SSTART (Output)
- FAN_SENSE (Input) 5
- 6 FAN_PWM (Output)
- Sync (Input) 7
- 8 +5V (Input)
- Gnd 9
- 10 +5V (Input)
- I/O isolators for communication with
- post-regulator PCB, Arduino breakout
- Note 9.1: Solder SW1 on the PCB's opposite side
- Licensed under the TAPR Open Hardware License (www.tapr.org/OHL)

## Sheet 10 of 11: SPI peripherals, TFT display
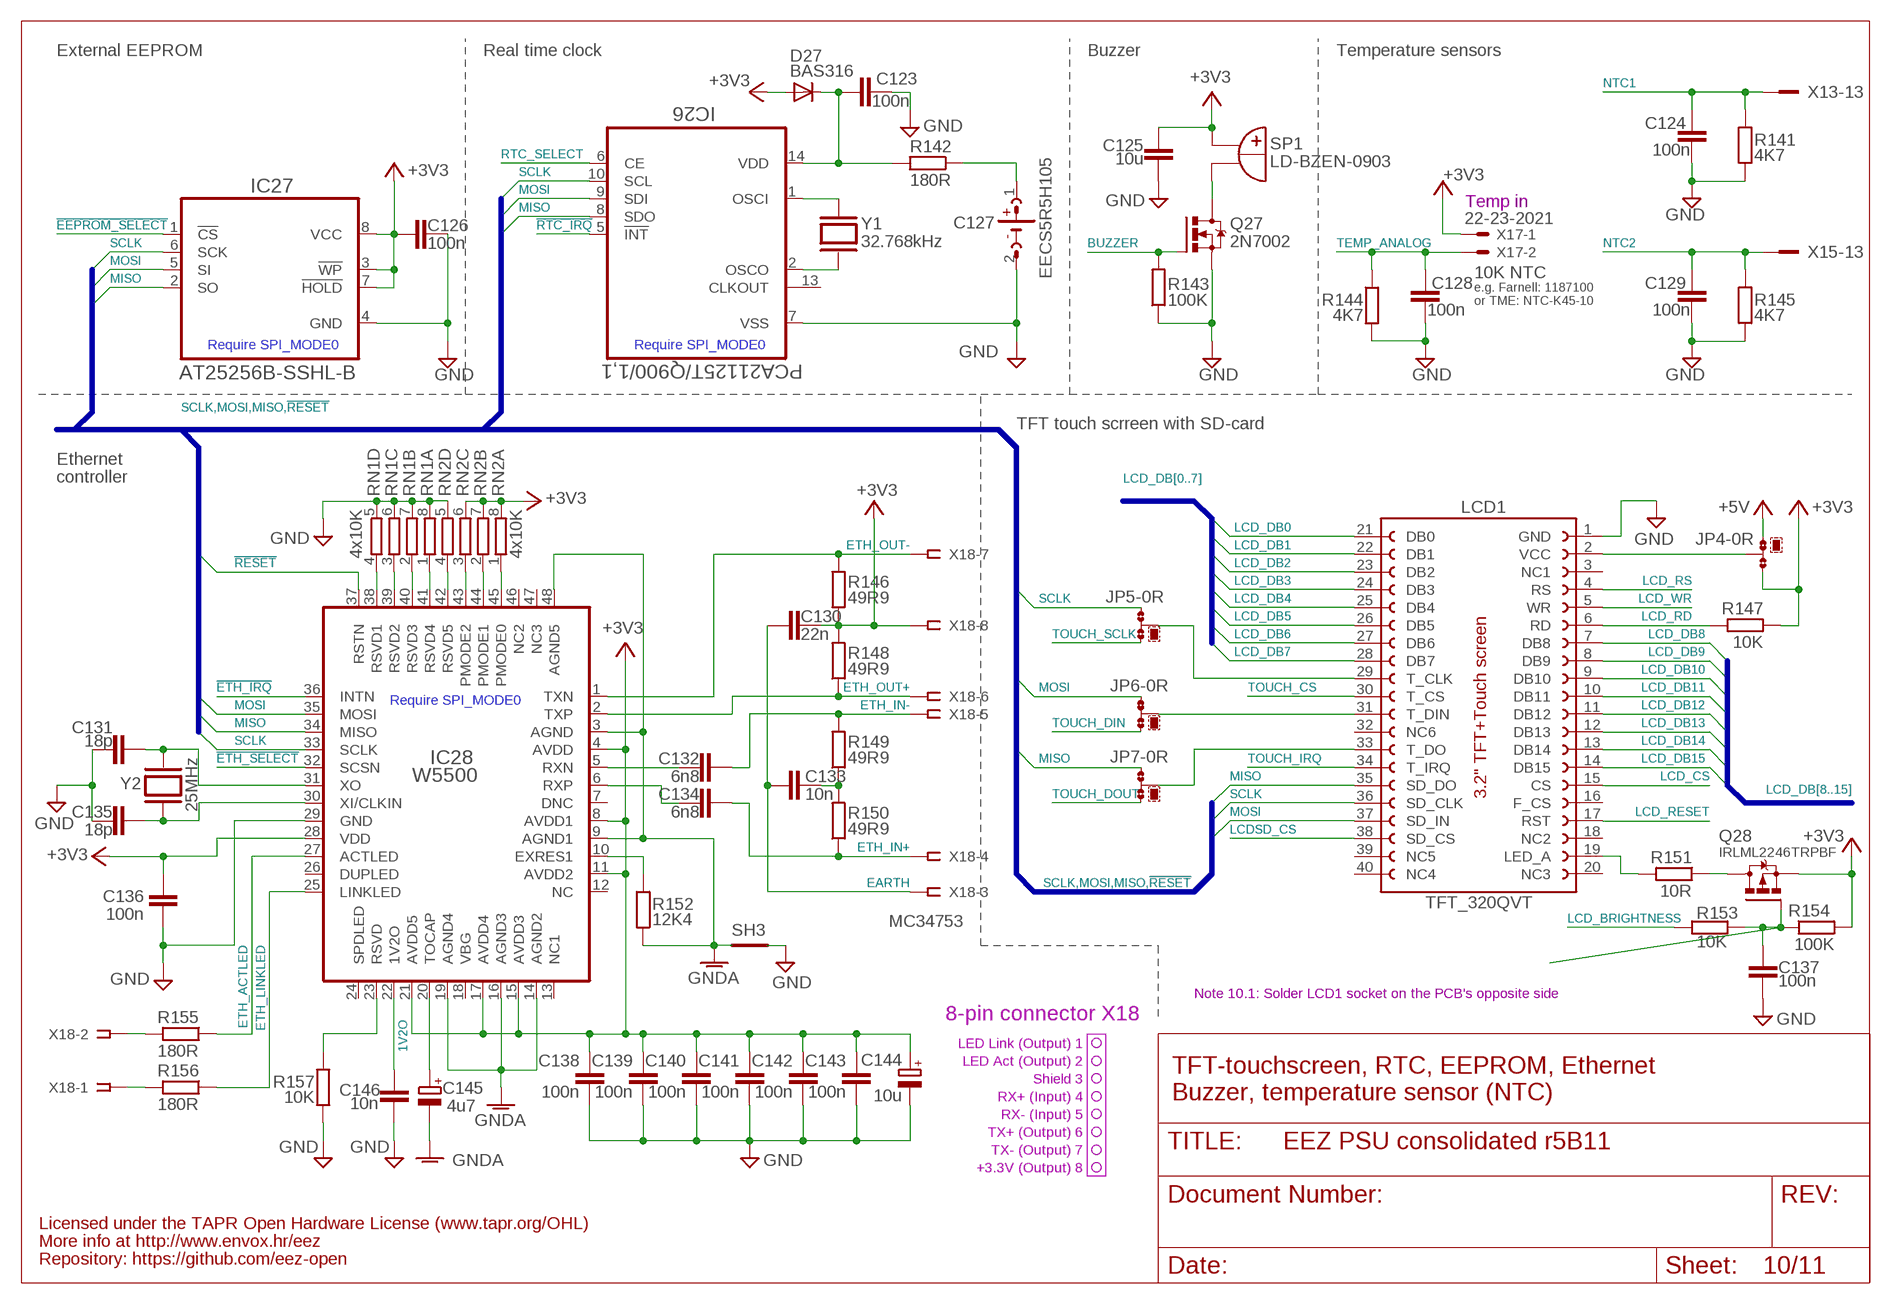
[diagram p9: schematic, sheet 10]

### Parts
C123  100n  C-EUC0603  [C0603]
C124  100n  C-EUC0603  [C0603]
C125  10u  C-EUC1210  [C1210]
C126  100n  C-EUC0603  [C0603]
C127  EECS5R5H105  SUPER_CAP  [SG-R20MM]
C128  100n  C-EUC0603  [C0603]
C129  100n  C-EUC0603  [C0603]
C130  22n  C-EUC0805  [C0805]
C131  18p  C-EUC0805  [C0805]
C132  6n8  C-EUC0603  [C0603]
C133  10n  C-EUC0805  [C0805]
C134  6n8  C-EUC0603  [C0603]
C135  18p  C-EUC0805  [C0805]
C136  100n  C-EUC0603  [C0603]
C137  100n  C-EUC0603  [C0603]
C138  100n  C-EUC0603  [C0603]
C139  100n  C-EUC0603  [C0603]
C140  100n  C-EUC0603  [C0603]
C141  100n  C-EUC0603  [C0603]
C142  100n  C-EUC0603  [C0603]
C143  100n  C-EUC0603  [C0603]
C144  10u  ECAP1206  [EC1206]
C145  4u7  ECAP1206  [EC1206]
C146  10n  C-EUC0805  [C0805]
D27  BAS316  DIODE-SOD323-W  [SOD323-W]
IC26  PCA21125T/Q900/1,1  PCA21125TSSOP-14  [SOP65P640X120-14N]
IC27  AT25256B-SSHL-B  AT25XXXSOIC8  [SOIC127P600X175-8N]
IC28  W5500  [TQFP48-7X7]
JP4  0R-JUMPA  [A0R-JMP]
JP5  0R-JUMPA  [A0R-JMP]
JP6  0R-JUMPA  [A0R-JMP]
JP7  0R-JUMPA  [A0R-JMP]
LCD1  TFT_320QVT  LCD_TFT_320QVT9341  [LCD_TFT_9341_MIRROR]
Q27  2N7002  [SOT103P240X110-3N]
Q28  IRLML2246TRPBF  [SOT95P237X112-3N]
R141  4K7  R-EU_R0805  [R0805]
R142  180R  R-EU_R0805  [R0805]
R143  100K  R-EU_R0805  [R0805]
R144  4K7  R-EU_R0805  [R0805]
R145  4K7  R-EU_R0805  [R0805]
R146  49R9  R-EU_R0805  [R0805]
R147  10K  R-EU_R0805  [R0805]
R148  49R9  R-EU_R0805  [R0805]
R149  49R9  R-EU_R0805  [R0805]
R150  49R9  R-EU_R0805  [R0805]
R151  10R  R-EU_R1206  [R1206]
R152  12K4  R-EU_R0805  [R0805]
R153  10K  R-EU_R0805  [R0805]
R154  100K  R-EU_R0805  [R0805]
R155  180R  R-EU_R0805  [R0805]
R156  180R  R-EU_R0805  [R0805]
R157  10K  R-EU_R0805  [R0805]
RN1  4x10K  R_ARRAY4  [CAY16]
RN2  4x10K  R_ARRAY4  [CAY16]
SH3  SHORTNOHOLE  [SHORT_NOHOLE]
SP1  LD-BZEN-0903  BUZZER-2  [LD-BZEN-0903]
X17  22-23-2021  [22-23-2021]
X18  MC34753  SSW-108-02-S-S  [SSW-108-02-S-S]
Y1  32.768kHz  XTALR26  [R26_XTAL]
Y2  25MHz  XTALSMD  [HC-49/4H]

### Nets
1V2O: C146.2 IC28.22(1V2O)
!EEPROM_SELECT: IC27.1(!CS) ; also sheet 9
!ETH_IRQ: IC28.36(INTN) ; also sheet 9
!ETH_SELECT: IC28.32(SCSN) ; also sheet 9
!RESET: IC28.37(RSTN) ; also sheet 9,11
!RTC_IRQ: IC26.5(!INT) ; also sheet 9
+3V3: C125.2 C126.1 C130.1 C136.2 C138.1 C139.1 C140.1 C141.1 C142.1 C143.1 C144.+ D27.A IC27.3(!WP) IC27.7(!HOLD) IC27.8(VCC) IC28.4(AVDD) IC28.8(AVDD1) IC28.11(AVDD2) IC28.15(AVDD3) IC28.17(AVDD4) IC28.21(AVDD5) IC28.28(VDD) JP4.3 Q28.2(S) R146.1 R147.2 R148.2 R154.2 RN2.6 RN2.7 RN2.8 SP1.+B(+) X17.1 X18.8 ; also sheet 8,9,11
+5V: JP4.1 ; also sheet 2,3,4,5,6,7,8,9,11
BUZZER: Q27.1(G) R143.2 ; also sheet 9
EARTH: C130.2 C133.2 X18.3 ; also sheet 1,8
ETH_ACTLED: IC28.27(ACTLED) R155.1
ETH_IN+: C134.1 R150.1 X18.4
ETH_IN-: C132.1 R149.2 X18.5
ETH_LINKLED: IC28.25(LINKLED) R156.1
ETH_OUT+: IC28.2(TXP) R148.1 X18.6
ETH_OUT-: IC28.1(TXN) R146.2 X18.7
GND [gnd]: C123.1 C124.1 C125.1 C126.2 C127.2(-) C128.1 C129.1 C131.2 C135.2 C136.1 C137.1 C138.2 C139.2 C140.2 C141.2 C142.2 C143.2 C144.- C146.1 IC26.7(VSS) IC27.4(GND) IC28.29(GND) LCD1.1(GND) Q27.2(S) R141.2 R143.1 R144.2 R145.2 R157.1 RN1.5 RN1.6 RN1.7 RN1.8 RN2.5 SH3.P$1(GND_A) ; also sheet 1,2,3,4,5,6,7,8,9,11
GNDA [gnd]: C145.- IC28.3(AGND) IC28.9(AGND1) IC28.14(AGND2) IC28.16(AGND3) IC28.19(AGND4) IC28.48(AGND5) R152.1 SH3.P$2(GND_B)
LCD_BRIGHTNESS: R153.1 ; also sheet 9
LCD_CS: LCD1.15(CS) ; also sheet 9
LCD_DB0: LCD1.21(DB0) ; also sheet 9
LCD_DB1: LCD1.22(DB1) ; also sheet 9
LCD_DB2: LCD1.23(DB2) ; also sheet 9
LCD_DB3: LCD1.24(DB3) ; also sheet 9
LCD_DB4: LCD1.25(DB4) ; also sheet 9
LCD_DB5: LCD1.26(DB5) ; also sheet 9
LCD_DB6: LCD1.27(DB6) ; also sheet 9
LCD_DB7: LCD1.28(DB7) ; also sheet 9
LCD_DB8: LCD1.7(DB8) ; also sheet 9
LCD_DB9: LCD1.8(DB9) ; also sheet 9
LCD_DB10: LCD1.9(DB10) ; also sheet 9
LCD_DB11: LCD1.10(DB11) ; also sheet 9
LCD_DB12: LCD1.11(DB12) ; also sheet 9
LCD_DB13: LCD1.12(DB13) ; also sheet 9
LCD_DB14: LCD1.13(DB14) ; also sheet 9
LCD_DB15: LCD1.14(DB15) ; also sheet 9
LCD_RD: LCD1.6(RD) R147.1
LCD_RESET: LCD1.17(RST) ; also sheet 9
LCD_RS: LCD1.4(RS) ; also sheet 9
LCD_WR: LCD1.5(WR) ; also sheet 9
LCDSD_CS: LCD1.38(SD_CS) ; also sheet 9
LED_A: LCD1.19(LED_A) R151.2
MISO: IC26.8(SDO) IC27.2(SO) IC28.34(MISO) JP7.1 LCD1.35(SD_DO) ; also sheet 9
MOSI: IC26.9(SDI) IC27.5(SI) IC28.35(MOSI) JP6.1 LCD1.37(SD_IN) ; also sheet 8,9
N$101: Q27.3(D) SP1.-B(-)
N$102: JP4.2 LCD1.2(VCC)
N$103: Q28.3(D) R151.1
N$104: JP7.2 LCD1.33(T_DO)
N$105: JP5.2 LCD1.29(T_CLK)
N$106: JP6.2 LCD1.31(T_DIN)
N$107: C127.1(+) R142.1
N$108: IC28.23(RSVD) R157.2
N$109: C123.2 D27.C IC26.14(VDD) R142.2
N$110: IC28.10(EXRES1) R152.2
N$111: C131.1 IC28.31(XO) Y2.1
N$112: C135.1 IC28.30(XI/CLKIN) Y2.2
N$113: C132.2 IC28.5(RXN)
N$115: C134.2 IC28.6(RXP)
N$116: R156.2 X18.1
N$118: R155.2 X18.2
N$119: IC28.43(PMODE2) RN2.3
N$120: IC28.44(PMODE1) RN2.2
N$121: IC28.45(PMODE0) RN2.1
N$122: IC28.42(RSVD5) RN2.4
N$123: IC28.38(RSVD1) RN1.4
N$124: C133.1 R149.1 R150.2
N$126: IC28.39(RSVD2) RN1.3
N$127: IC28.41(RSVD4) RN1.1
N$130: IC28.40(RSVD3) RN1.2
N$132: C137.2 Q28.1(G) R153.2 R154.1
N$133: IC26.1(OSCI) Y1.2
N$134: IC26.2(OSCO) Y1.1
NTC1: C124.2 R141.1 X13.13 ; also sheet 9
NTC2: C129.2 R145.1 X15.13 ; also sheet 9
RTC_SELECT: IC26.6(CE) ; also sheet 9
SCLK: IC26.10(SCL) IC27.6(SCK) IC28.33(SCLK) JP5.1 LCD1.36(SD_CLK) ; also sheet 8,9
TEMP_ANALOG: C128.2 R144.1 X17.2 ; also sheet 9
TOCAP: C145.+ IC28.20(TOCAP)
TOUCH_CS: LCD1.30(T_CS) ; also sheet 9
TOUCH_DIN: JP6.3 ; also sheet 9
TOUCH_DOUT: JP7.3 ; also sheet 9
TOUCH_IRQ: LCD1.34(T_IRQ) ; also sheet 9
TOUCH_SCLK: JP5.3 ; also sheet 9
Unconnected: IC26.13(CLKOUT) IC28.7(DNC) IC28.12(NC) IC28.13(NC1) IC28.18(VBG) IC28.24(SPDLED) IC28.26(DUPLED) IC28.46(NC2) IC28.47(NC3) LCD1.3(NC1) LCD1.16(F_CS) LCD1.18(NC2) LCD1.20(NC3) LCD1.32(NC6) LCD1.39(NC5) LCD1.40(NC4)

### Buses
SCLK,MOSI,MISO,!RESET
LCD_DB[0..7]
LCD_DB[8..15]

### Notes on the sheet
- External EEPROM | Real time clock | Buzzer | Temperature sensors
- Temp in
- 10K NTC
- e.g. Farnell: 1187100
- or TME: NTC-K45-10
- Require SPI_MODE0 | Require SPI_MODE0
- TFT touch scrreen with SD-card
- Ethernet
- controller
- Require SPI_MODE0
- Note 10.1: Solder LCD1 socket on the PCB's opposite side
- 8-pin connector X18
- LED Link (Output) 1
- LED Act (Output) 2
- Shield 3 | TFT-touchscreen, RTC, EEPROM, Ethernet
- RX+ (Input) 4
- Buzzer, temperature sensor (NTC)
- RX- (Input) 5
- TX+ (Output) 6
- TX- (Output) 7
- +3.3V (Output) 8
- Licensed under the TAPR Open Hardware License (www.tapr.org/OHL)
- More info at http://www.envox.hr/eez
- Repository: https://github.com/eez-open